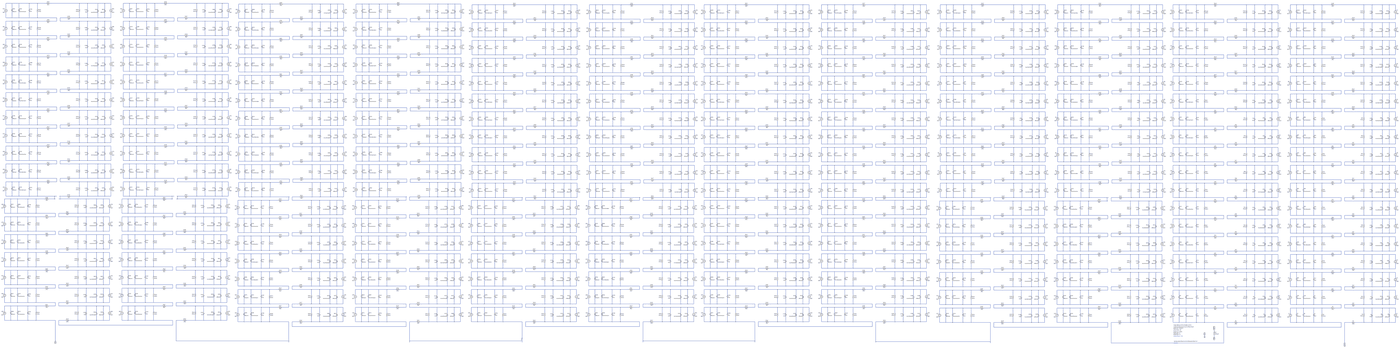
[diagram p0: schematic jac--m5sf-2--array.asc, whole sheet]
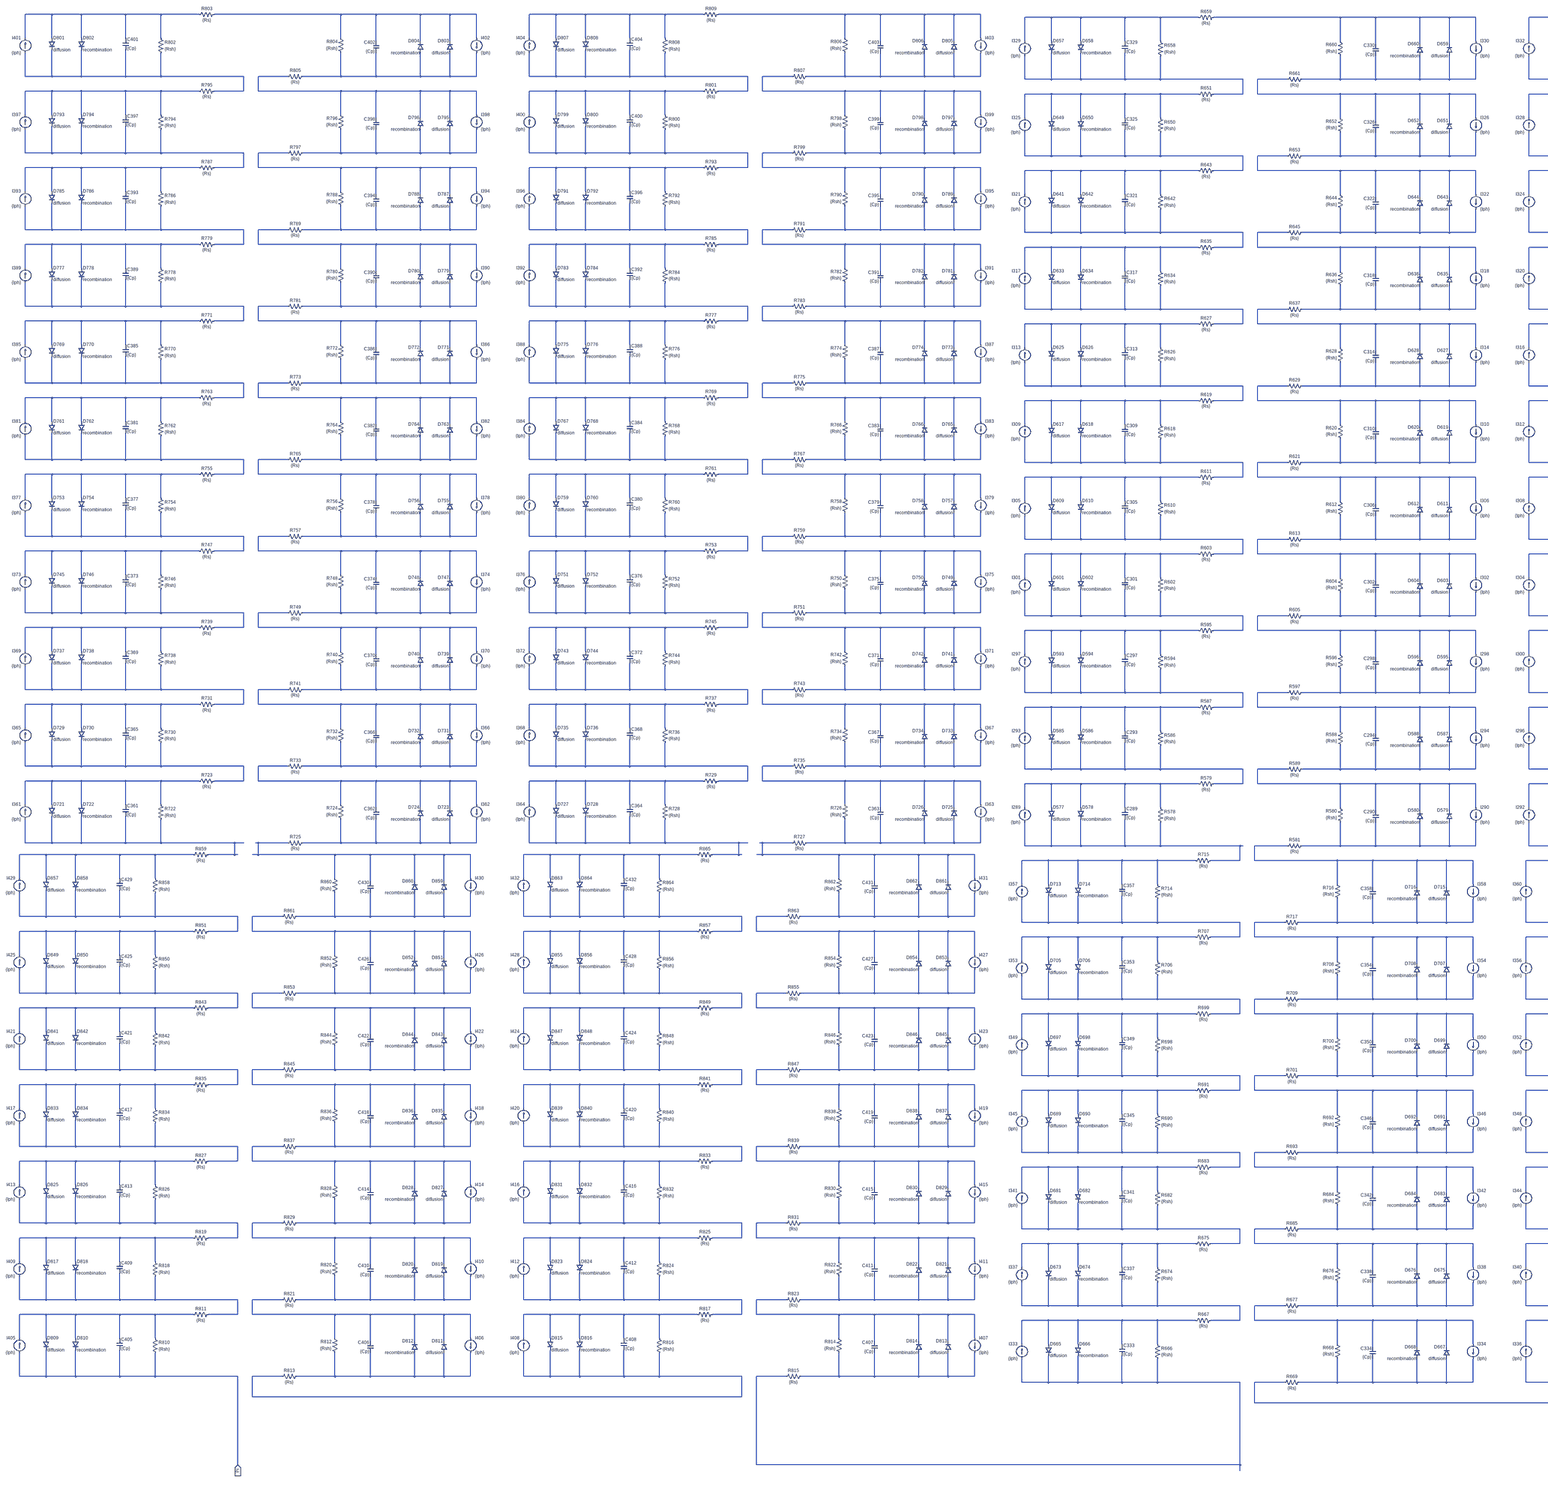
[diagram p1: schematic jac--m5sf-2--array.asc, part, row 1 of 1, column 1 of 4]
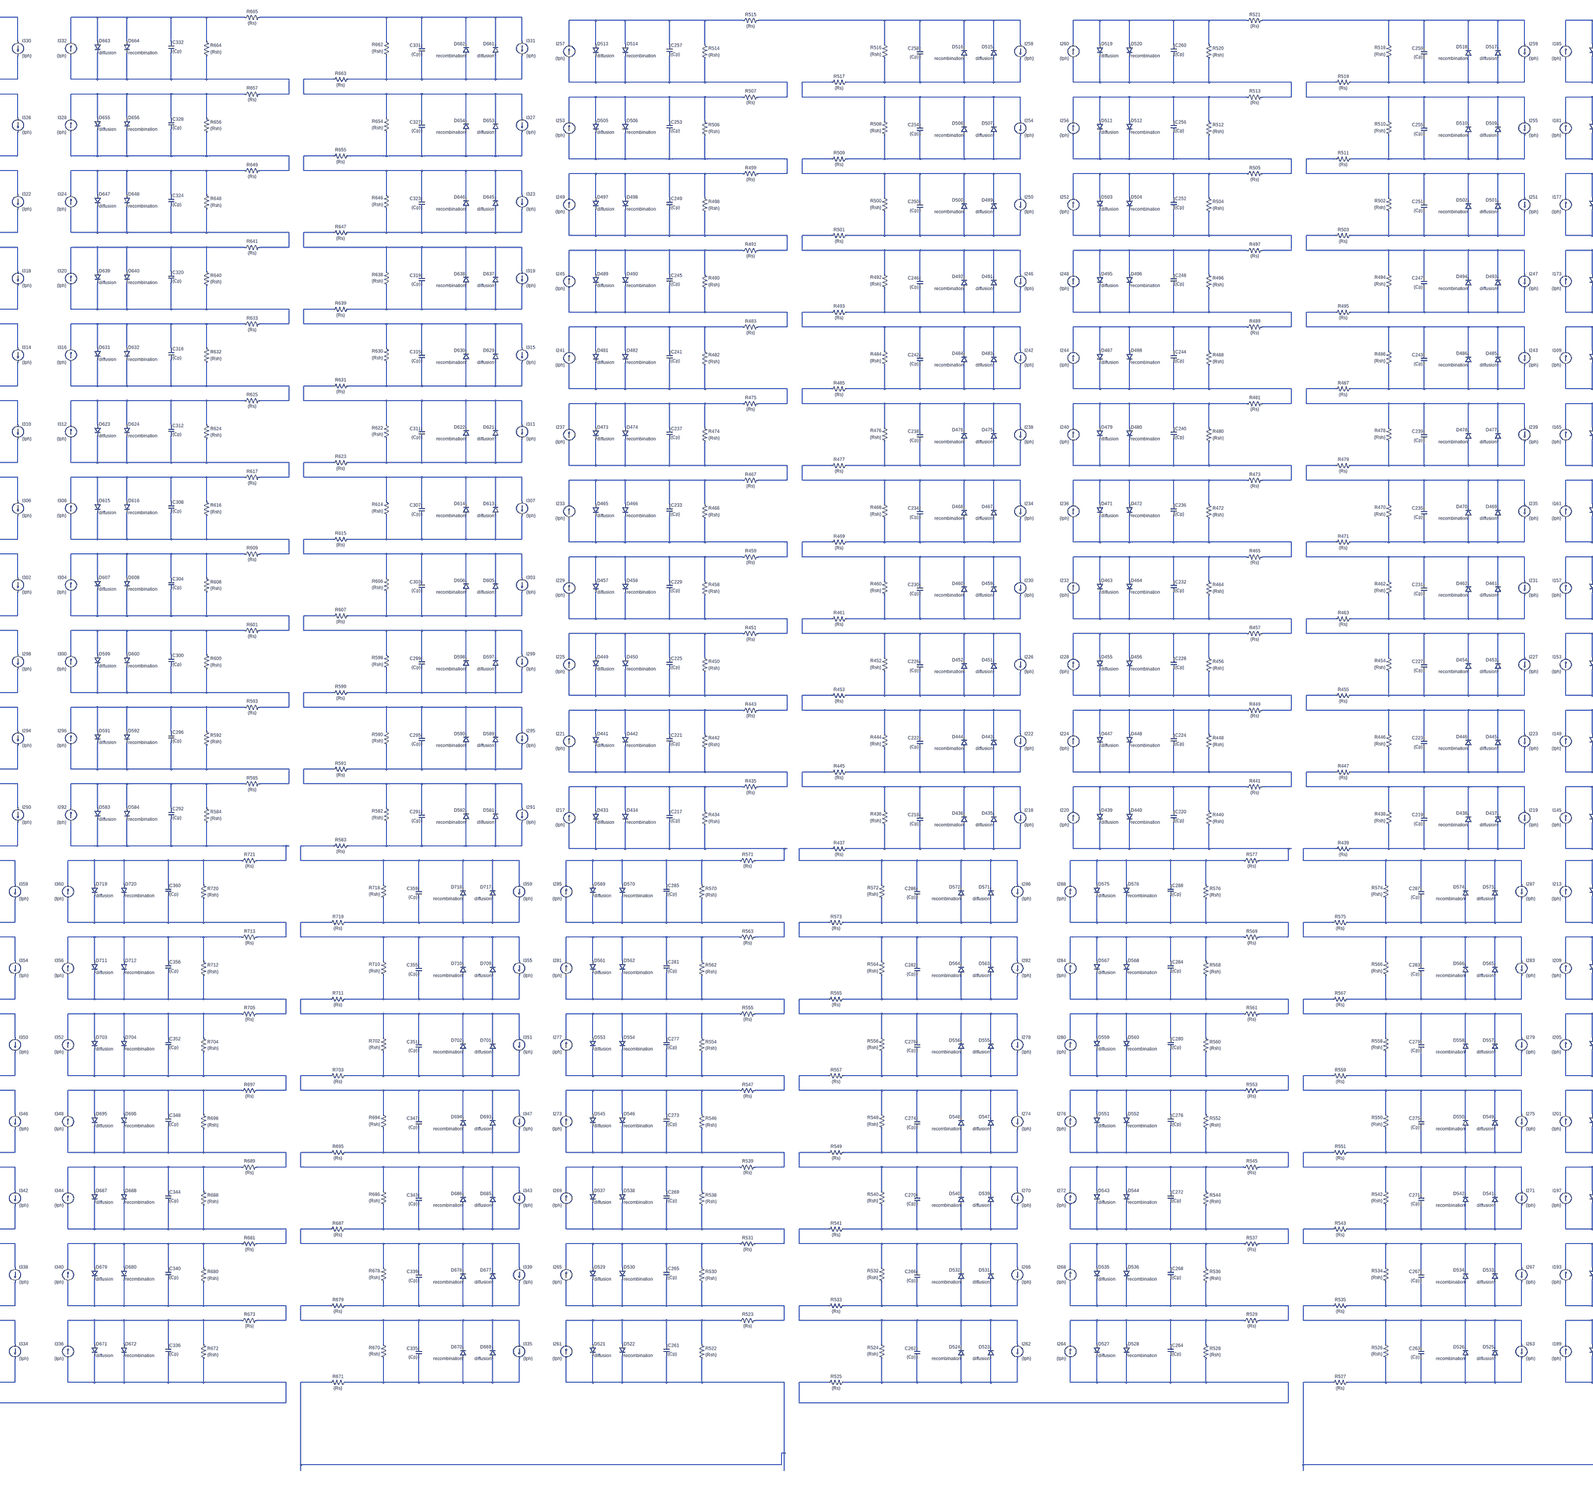
[diagram p2: schematic jac--m5sf-2--array.asc, part, row 1 of 1, column 2 of 4]
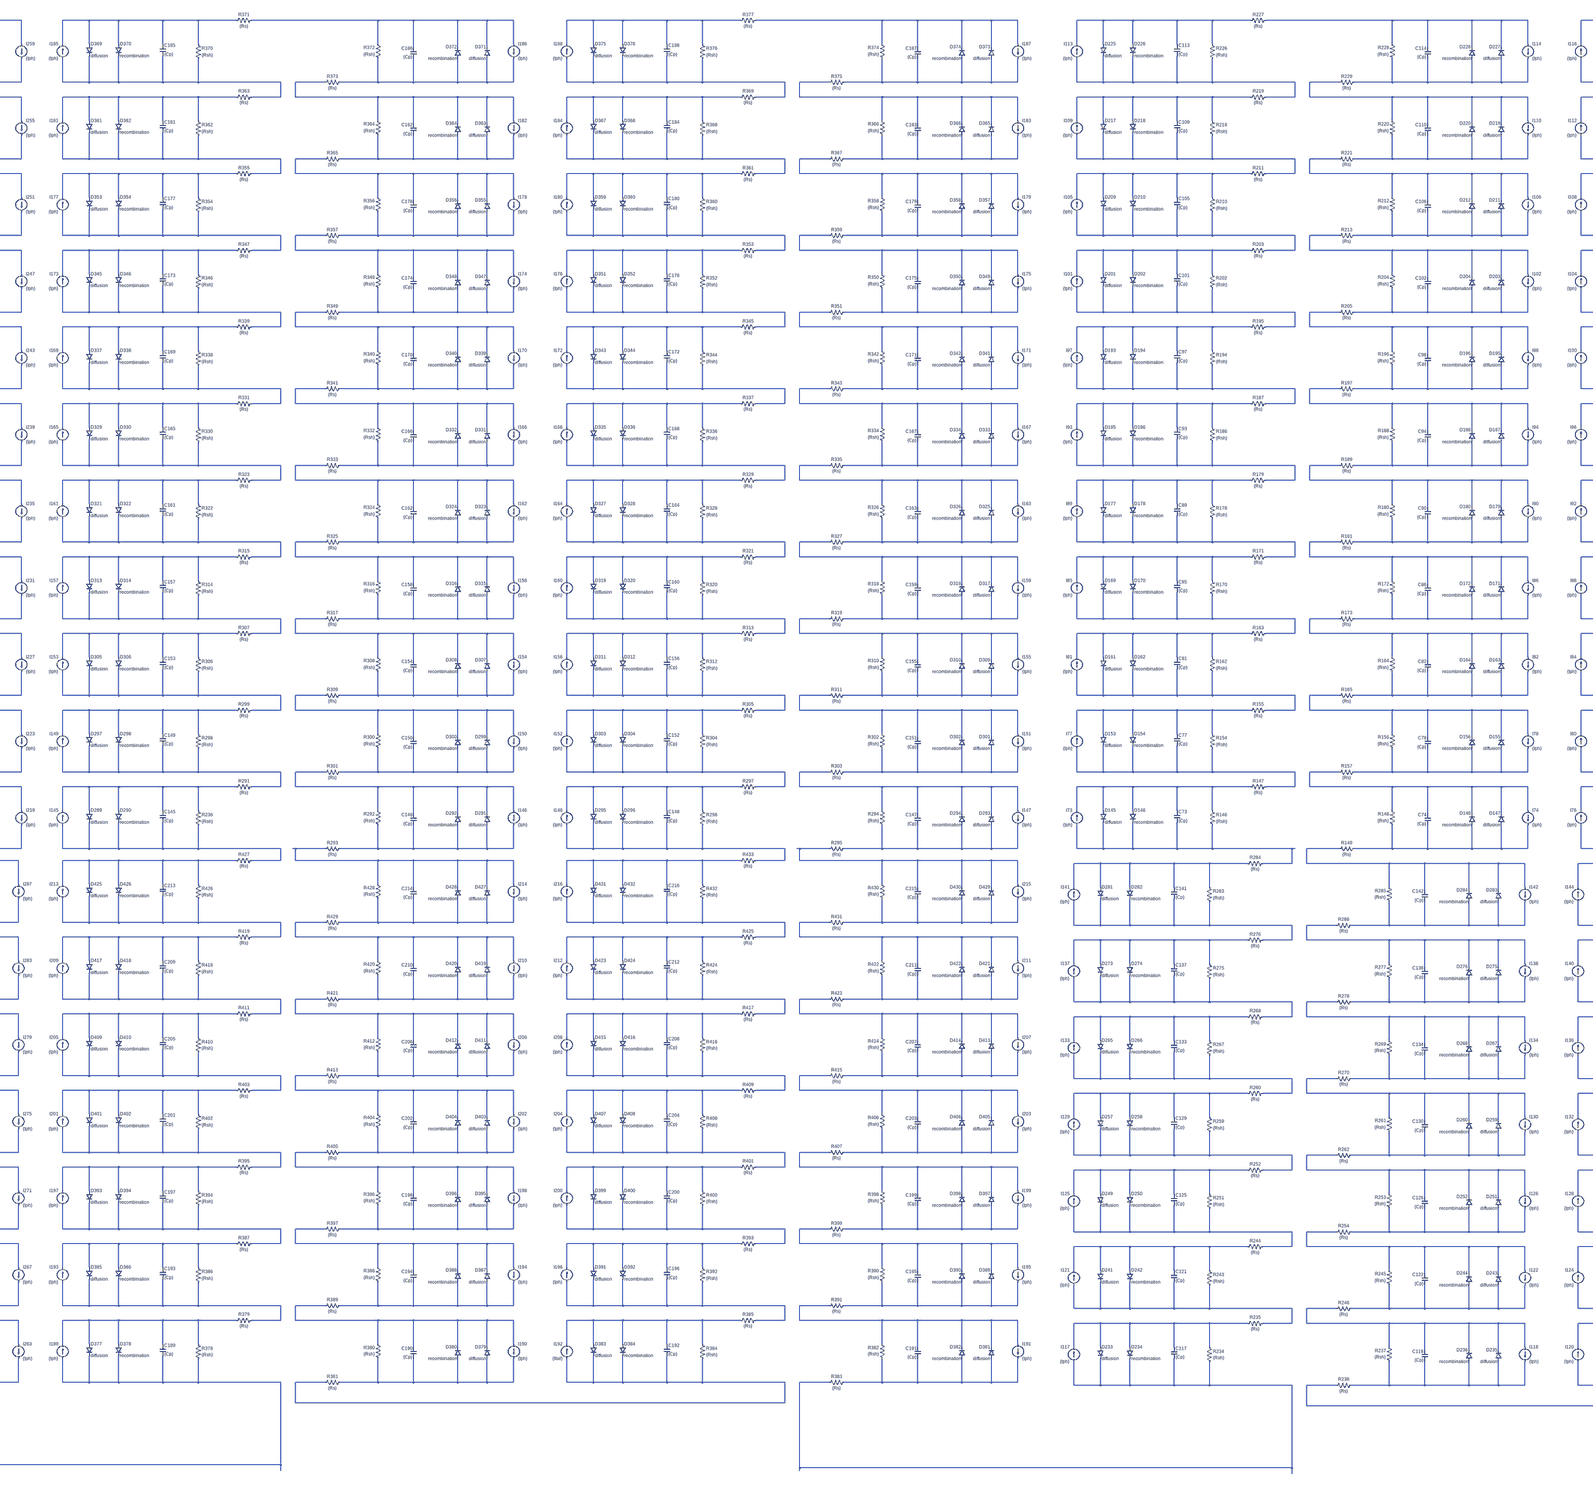
[diagram p3: schematic jac--m5sf-2--array.asc, part, row 1 of 1, column 3 of 4]
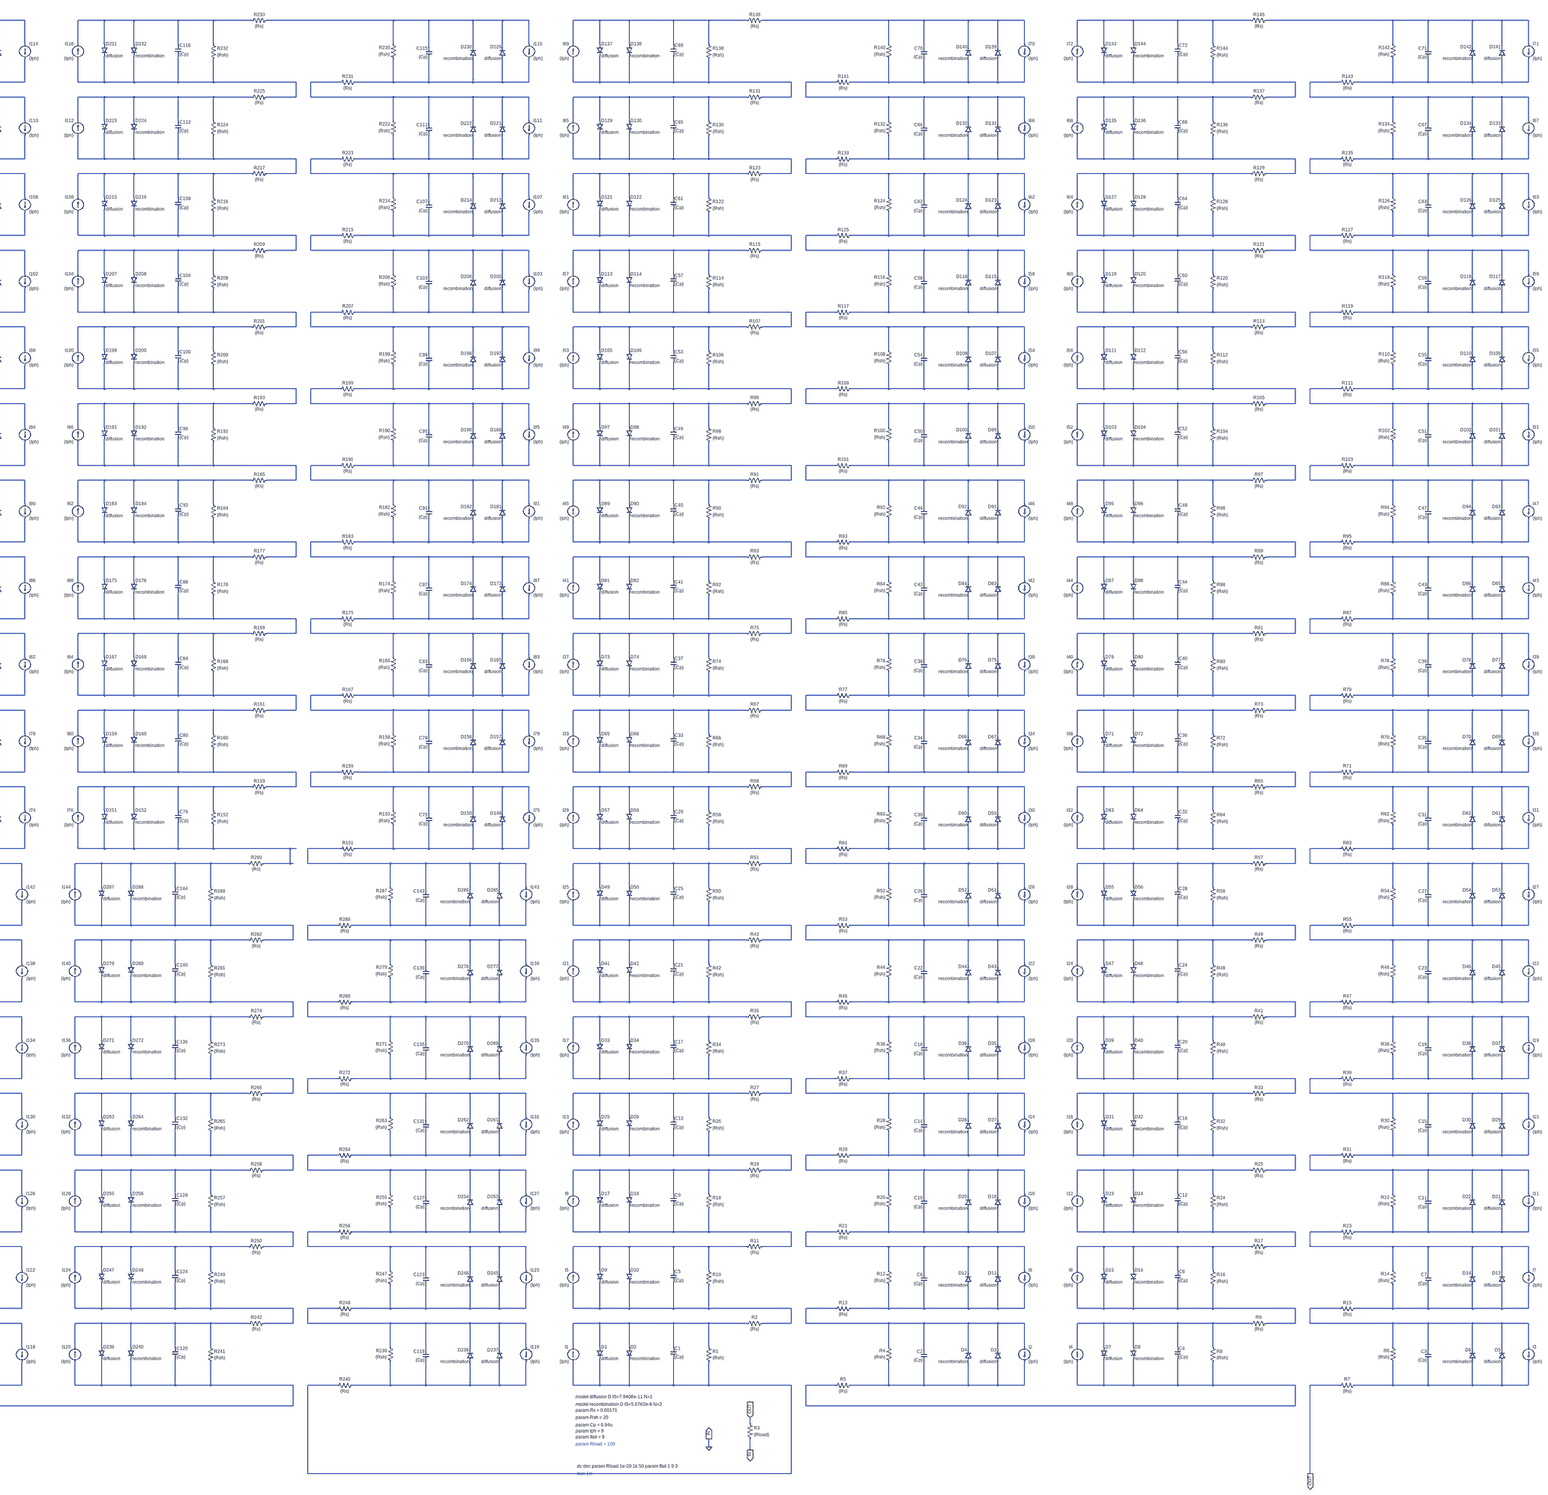
[diagram p4: schematic jac--m5sf-2--array.asc, part, row 1 of 1, column 4 of 4]
* jac--m5sf-2--array.asc
I1 N859 N839 {Iph}
D1 N839 N859 diffusion
D2 N839 N859 recombination
C1 N839 N859 {Cp}
R1 N839 N859 {Rsh}
R2 N839 N823 {Rs}
R3 OUT 0 {Rload}
I2 N824 N862 {Iph}
D3 N862 N824 diffusion
D4 N862 N824 recombination
C2 N862 N824 {Cp}
R4 N862 N824 {Rsh}
R5 N862 N861 {Rs}
I3 N827 N863 {Iph}
D5 N863 N827 diffusion
D6 N863 N827 recombination
C3 N863 N827 {Cp}
R6 N863 N827 {Rsh}
R7 N863 OUT {Rs}
I4 N861 N840 {Iph}
D7 N840 N861 diffusion
D8 N840 N861 recombination
C4 N840 N861 {Cp}
R8 N840 N861 {Rsh}
R9 N840 N826 {Rs}
I5 N823 N791 {Iph}
D9 N791 N823 diffusion
D10 N791 N823 recombination
C5 N791 N823 {Cp}
R10 N791 N823 {Rsh}
R11 N791 N775 {Rs}
I6 N776 N825 {Iph}
D11 N825 N776 diffusion
D12 N825 N776 recombination
C6 N825 N776 {Cp}
R12 N825 N776 {Rsh}
R13 N825 N824 {Rs}
I7 N779 N828 {Iph}
D13 N828 N779 diffusion
D14 N828 N779 recombination
C7 N828 N779 {Cp}
R14 N828 N779 {Rsh}
R15 N828 N827 {Rs}
I8 N826 N792 {Iph}
D15 N792 N826 diffusion
D16 N792 N826 recombination
C8 N792 N826 {Cp}
R16 N792 N826 {Rsh}
R17 N792 N778 {Rs}
I9 N775 N743 {Iph}
D17 N743 N775 diffusion
D18 N743 N775 recombination
C9 N743 N775 {Cp}
R18 N743 N775 {Rsh}
R19 N743 N727 {Rs}
I10 N728 N777 {Iph}
D19 N777 N728 diffusion
D20 N777 N728 recombination
C10 N777 N728 {Cp}
R20 N777 N728 {Rsh}
R21 N777 N776 {Rs}
I11 N731 N780 {Iph}
D21 N780 N731 diffusion
D22 N780 N731 recombination
C11 N780 N731 {Cp}
R22 N780 N731 {Rsh}
R23 N780 N779 {Rs}
I12 N778 N744 {Iph}
D23 N744 N778 diffusion
D24 N744 N778 recombination
C12 N744 N778 {Cp}
R24 N744 N778 {Rsh}
R25 N744 N730 {Rs}
I13 N727 N695 {Iph}
D25 N695 N727 diffusion
D26 N695 N727 recombination
C13 N695 N727 {Cp}
R26 N695 N727 {Rsh}
R27 N695 N679 {Rs}
I14 N680 N729 {Iph}
D27 N729 N680 diffusion
D28 N729 N680 recombination
C14 N729 N680 {Cp}
R28 N729 N680 {Rsh}
R29 N729 N728 {Rs}
I15 N683 N732 {Iph}
D29 N732 N683 diffusion
D30 N732 N683 recombination
C15 N732 N683 {Cp}
R30 N732 N683 {Rsh}
R31 N732 N731 {Rs}
I16 N730 N696 {Iph}
D31 N696 N730 diffusion
D32 N696 N730 recombination
C16 N696 N730 {Cp}
R32 N696 N730 {Rsh}
R33 N696 N682 {Rs}
I17 N679 N647 {Iph}
D33 N647 N679 diffusion
D34 N647 N679 recombination
C17 N647 N679 {Cp}
R34 N647 N679 {Rsh}
R35 N647 N631 {Rs}
I18 N632 N681 {Iph}
D35 N681 N632 diffusion
D36 N681 N632 recombination
C18 N681 N632 {Cp}
R36 N681 N632 {Rsh}
R37 N681 N680 {Rs}
I19 N635 N684 {Iph}
D37 N684 N635 diffusion
D38 N684 N635 recombination
C19 N684 N635 {Cp}
R38 N684 N635 {Rsh}
R39 N684 N683 {Rs}
I20 N682 N648 {Iph}
D39 N648 N682 diffusion
D40 N648 N682 recombination
C20 N648 N682 {Cp}
R40 N648 N682 {Rsh}
R41 N648 N634 {Rs}
I21 N631 N599 {Iph}
D41 N599 N631 diffusion
D42 N599 N631 recombination
C21 N599 N631 {Cp}
R42 N599 N631 {Rsh}
R43 N599 N583 {Rs}
I22 N584 N633 {Iph}
D43 N633 N584 diffusion
D44 N633 N584 recombination
C22 N633 N584 {Cp}
R44 N633 N584 {Rsh}
R45 N633 N632 {Rs}
I23 N587 N636 {Iph}
D45 N636 N587 diffusion
D46 N636 N587 recombination
C23 N636 N587 {Cp}
R46 N636 N587 {Rsh}
R47 N636 N635 {Rs}
I24 N634 N600 {Iph}
D47 N600 N634 diffusion
D48 N600 N634 recombination
C24 N600 N634 {Cp}
R48 N600 N634 {Rsh}
R49 N600 N586 {Rs}
I25 N583 N551 {Iph}
D49 N551 N583 diffusion
D50 N551 N583 recombination
C25 N551 N583 {Cp}
R50 N551 N583 {Rsh}
R51 N551 N535 {Rs}
I26 N536 N585 {Iph}
D51 N585 N536 diffusion
D52 N585 N536 recombination
C26 N585 N536 {Cp}
R52 N585 N536 {Rsh}
R53 N585 N584 {Rs}
I27 N539 N588 {Iph}
D53 N588 N539 diffusion
D54 N588 N539 recombination
C27 N588 N539 {Cp}
R54 N588 N539 {Rsh}
R55 N588 N587 {Rs}
I28 N586 N552 {Iph}
D55 N552 N586 diffusion
D56 N552 N586 recombination
C28 N552 N586 {Cp}
R56 N552 N586 {Rsh}
R57 N552 N538 {Rs}
I29 N535 N503 {Iph}
D57 N503 N535 diffusion
D58 N503 N535 recombination
C29 N503 N535 {Cp}
R58 N503 N535 {Rsh}
R59 N503 N487 {Rs}
I30 N488 N537 {Iph}
D59 N537 N488 diffusion
D60 N537 N488 recombination
C30 N537 N488 {Cp}
R60 N537 N488 {Rsh}
R61 N537 N536 {Rs}
I31 N491 N540 {Iph}
D61 N540 N491 diffusion
D62 N540 N491 recombination
C31 N540 N491 {Cp}
R62 N540 N491 {Rsh}
R63 N540 N539 {Rs}
I32 N538 N504 {Iph}
D63 N504 N538 diffusion
D64 N504 N538 recombination
C32 N504 N538 {Cp}
R64 N504 N538 {Rsh}
R65 N504 N490 {Rs}
I33 N487 N455 {Iph}
D65 N455 N487 diffusion
D66 N455 N487 recombination
C33 N455 N487 {Cp}
R66 N455 N487 {Rsh}
R67 N455 N439 {Rs}
I34 N440 N489 {Iph}
D67 N489 N440 diffusion
D68 N489 N440 recombination
C34 N489 N440 {Cp}
R68 N489 N440 {Rsh}
R69 N489 N488 {Rs}
I35 N443 N492 {Iph}
D69 N492 N443 diffusion
D70 N492 N443 recombination
C35 N492 N443 {Cp}
R70 N492 N443 {Rsh}
R71 N492 N491 {Rs}
I36 N490 N456 {Iph}
D71 N456 N490 diffusion
D72 N456 N490 recombination
C36 N456 N490 {Cp}
R72 N456 N490 {Rsh}
R73 N456 N442 {Rs}
I37 N439 N407 {Iph}
D73 N407 N439 diffusion
D74 N407 N439 recombination
C37 N407 N439 {Cp}
R74 N407 N439 {Rsh}
R75 N407 N391 {Rs}
I38 N392 N441 {Iph}
D75 N441 N392 diffusion
D76 N441 N392 recombination
C38 N441 N392 {Cp}
R76 N441 N392 {Rsh}
R77 N441 N440 {Rs}
I39 N395 N444 {Iph}
D77 N444 N395 diffusion
D78 N444 N395 recombination
C39 N444 N395 {Cp}
R78 N444 N395 {Rsh}
R79 N444 N443 {Rs}
I40 N442 N408 {Iph}
D79 N408 N442 diffusion
D80 N408 N442 recombination
C40 N408 N442 {Cp}
R80 N408 N442 {Rsh}
R81 N408 N394 {Rs}
I41 N391 N359 {Iph}
D81 N359 N391 diffusion
D82 N359 N391 recombination
C41 N359 N391 {Cp}
R82 N359 N391 {Rsh}
R83 N359 N343 {Rs}
I42 N344 N393 {Iph}
D83 N393 N344 diffusion
D84 N393 N344 recombination
C42 N393 N344 {Cp}
R84 N393 N344 {Rsh}
R85 N393 N392 {Rs}
I43 N347 N396 {Iph}
D85 N396 N347 diffusion
D86 N396 N347 recombination
C43 N396 N347 {Cp}
R86 N396 N347 {Rsh}
R87 N396 N395 {Rs}
I44 N394 N360 {Iph}
D87 N360 N394 diffusion
D88 N360 N394 recombination
C44 N360 N394 {Cp}
R88 N360 N394 {Rsh}
R89 N360 N346 {Rs}
I45 N343 N311 {Iph}
D89 N311 N343 diffusion
D90 N311 N343 recombination
C45 N311 N343 {Cp}
R90 N311 N343 {Rsh}
R91 N311 N295 {Rs}
I46 N296 N345 {Iph}
D91 N345 N296 diffusion
D92 N345 N296 recombination
C46 N345 N296 {Cp}
R92 N345 N296 {Rsh}
R93 N345 N344 {Rs}
I47 N299 N348 {Iph}
D93 N348 N299 diffusion
D94 N348 N299 recombination
C47 N348 N299 {Cp}
R94 N348 N299 {Rsh}
R95 N348 N347 {Rs}
I48 N346 N312 {Iph}
D95 N312 N346 diffusion
D96 N312 N346 recombination
C48 N312 N346 {Cp}
R96 N312 N346 {Rsh}
R97 N312 N298 {Rs}
I49 N295 N263 {Iph}
D97 N263 N295 diffusion
D98 N263 N295 recombination
C49 N263 N295 {Cp}
R98 N263 N295 {Rsh}
R99 N263 N247 {Rs}
I50 N248 N297 {Iph}
D99 N297 N248 diffusion
D100 N297 N248 recombination
C50 N297 N248 {Cp}
R100 N297 N248 {Rsh}
R101 N297 N296 {Rs}
I51 N251 N300 {Iph}
D101 N300 N251 diffusion
D102 N300 N251 recombination
C51 N300 N251 {Cp}
R102 N300 N251 {Rsh}
R103 N300 N299 {Rs}
I52 N298 N264 {Iph}
D103 N264 N298 diffusion
D104 N264 N298 recombination
C52 N264 N298 {Cp}
R104 N264 N298 {Rsh}
R105 N264 N250 {Rs}
I53 N247 N215 {Iph}
D105 N215 N247 diffusion
D106 N215 N247 recombination
C53 N215 N247 {Cp}
R106 N215 N247 {Rsh}
R107 N215 N199 {Rs}
I54 N200 N249 {Iph}
D107 N249 N200 diffusion
D108 N249 N200 recombination
C54 N249 N200 {Cp}
R108 N249 N200 {Rsh}
R109 N249 N248 {Rs}
I55 N203 N252 {Iph}
D109 N252 N203 diffusion
D110 N252 N203 recombination
C55 N252 N203 {Cp}
R110 N252 N203 {Rsh}
R111 N252 N251 {Rs}
I56 N250 N216 {Iph}
D111 N216 N250 diffusion
D112 N216 N250 recombination
C56 N216 N250 {Cp}
R112 N216 N250 {Rsh}
R113 N216 N202 {Rs}
I57 N199 N167 {Iph}
D113 N167 N199 diffusion
D114 N167 N199 recombination
C57 N167 N199 {Cp}
R114 N167 N199 {Rsh}
R115 N167 N151 {Rs}
I58 N152 N201 {Iph}
D115 N201 N152 diffusion
D116 N201 N152 recombination
C58 N201 N152 {Cp}
R116 N201 N152 {Rsh}
R117 N201 N200 {Rs}
I59 N155 N204 {Iph}
D117 N204 N155 diffusion
D118 N204 N155 recombination
C59 N204 N155 {Cp}
R118 N204 N155 {Rsh}
R119 N204 N203 {Rs}
I60 N202 N168 {Iph}
D119 N168 N202 diffusion
D120 N168 N202 recombination
C60 N168 N202 {Cp}
R120 N168 N202 {Rsh}
R121 N168 N154 {Rs}
I61 N151 N119 {Iph}
D121 N119 N151 diffusion
D122 N119 N151 recombination
C61 N119 N151 {Cp}
R122 N119 N151 {Rsh}
R123 N119 N103 {Rs}
I62 N104 N153 {Iph}
D123 N153 N104 diffusion
D124 N153 N104 recombination
C62 N153 N104 {Cp}
R124 N153 N104 {Rsh}
R125 N153 N152 {Rs}
I63 N107 N156 {Iph}
D125 N156 N107 diffusion
D126 N156 N107 recombination
C63 N156 N107 {Cp}
R126 N156 N107 {Rsh}
R127 N156 N155 {Rs}
I64 N154 N120 {Iph}
D127 N120 N154 diffusion
D128 N120 N154 recombination
C64 N120 N154 {Cp}
R128 N120 N154 {Rsh}
R129 N120 N106 {Rs}
I65 N103 N071 {Iph}
D129 N071 N103 diffusion
D130 N071 N103 recombination
C65 N071 N103 {Cp}
R130 N071 N103 {Rsh}
R131 N071 N055 {Rs}
I66 N056 N105 {Iph}
D131 N105 N056 diffusion
D132 N105 N056 recombination
C66 N105 N056 {Cp}
R132 N105 N056 {Rsh}
R133 N105 N104 {Rs}
I67 N059 N108 {Iph}
D133 N108 N059 diffusion
D134 N108 N059 recombination
C67 N108 N059 {Cp}
R134 N108 N059 {Rsh}
R135 N108 N107 {Rs}
I68 N106 N072 {Iph}
D135 N072 N106 diffusion
D136 N072 N106 recombination
C68 N072 N106 {Cp}
R136 N072 N106 {Rsh}
R137 N072 N058 {Rs}
I69 N055 N021 {Iph}
D137 N021 N055 diffusion
D138 N021 N055 recombination
C69 N021 N055 {Cp}
R138 N021 N055 {Rsh}
R139 N021 N022 {Rs}
I70 N022 N057 {Iph}
D139 N057 N022 diffusion
D140 N057 N022 recombination
C70 N057 N022 {Cp}
R140 N057 N022 {Rsh}
R141 N057 N056 {Rs}
I71 N024 N060 {Iph}
D141 N060 N024 diffusion
D142 N060 N024 recombination
C71 N060 N024 {Cp}
R142 N060 N024 {Rsh}
R143 N060 N059 {Rs}
I72 N058 N023 {Iph}
D143 N023 N058 diffusion
D144 N023 N058 recombination
C72 N023 N058 {Cp}
R144 N023 N058 {Rsh}
R145 N023 N024 {Rs}
I73 N529 N501 {Iph}
D145 N501 N529 diffusion
D146 N501 N529 recombination
C73 N501 N529 {Cp}
R146 N501 N529 {Rsh}
R147 N501 N481 {Rs}
I74 N482 N531 {Iph}
D147 N531 N482 diffusion
D148 N531 N482 recombination
C74 N531 N482 {Cp}
R148 N531 N482 {Rsh}
R149 N531 N530 {Rs}
I75 N485 N534 {Iph}
D149 N534 N485 diffusion
D150 N534 N485 recombination
C75 N534 N485 {Cp}
R150 N534 N485 {Rsh}
R151 N534 N533 {Rs}
I76 N532 N502 {Iph}
D151 N502 N532 diffusion
D152 N502 N532 recombination
C76 N502 N532 {Cp}
R152 N502 N532 {Rsh}
R153 N502 N484 {Rs}
I77 N481 N453 {Iph}
D153 N453 N481 diffusion
D154 N453 N481 recombination
C77 N453 N481 {Cp}
R154 N453 N481 {Rsh}
R155 N453 N433 {Rs}
I78 N434 N483 {Iph}
D155 N483 N434 diffusion
D156 N483 N434 recombination
C78 N483 N434 {Cp}
R156 N483 N434 {Rsh}
R157 N483 N482 {Rs}
I79 N437 N486 {Iph}
D157 N486 N437 diffusion
D158 N486 N437 recombination
C79 N486 N437 {Cp}
R158 N486 N437 {Rsh}
R159 N486 N485 {Rs}
I80 N484 N454 {Iph}
D159 N454 N484 diffusion
D160 N454 N484 recombination
C80 N454 N484 {Cp}
R160 N454 N484 {Rsh}
R161 N454 N436 {Rs}
I81 N433 N405 {Iph}
D161 N405 N433 diffusion
D162 N405 N433 recombination
C81 N405 N433 {Cp}
R162 N405 N433 {Rsh}
R163 N405 N385 {Rs}
I82 N386 N435 {Iph}
D163 N435 N386 diffusion
D164 N435 N386 recombination
C82 N435 N386 {Cp}
R164 N435 N386 {Rsh}
R165 N435 N434 {Rs}
I83 N389 N438 {Iph}
D165 N438 N389 diffusion
D166 N438 N389 recombination
C83 N438 N389 {Cp}
R166 N438 N389 {Rsh}
R167 N438 N437 {Rs}
I84 N436 N406 {Iph}
D167 N406 N436 diffusion
D168 N406 N436 recombination
C84 N406 N436 {Cp}
R168 N406 N436 {Rsh}
R169 N406 N388 {Rs}
I85 N385 N357 {Iph}
D169 N357 N385 diffusion
D170 N357 N385 recombination
C85 N357 N385 {Cp}
R170 N357 N385 {Rsh}
R171 N357 N337 {Rs}
I86 N338 N387 {Iph}
D171 N387 N338 diffusion
D172 N387 N338 recombination
C86 N387 N338 {Cp}
R172 N387 N338 {Rsh}
R173 N387 N386 {Rs}
I87 N341 N390 {Iph}
D173 N390 N341 diffusion
D174 N390 N341 recombination
C87 N390 N341 {Cp}
R174 N390 N341 {Rsh}
R175 N390 N389 {Rs}
I88 N388 N358 {Iph}
D175 N358 N388 diffusion
D176 N358 N388 recombination
C88 N358 N388 {Cp}
R176 N358 N388 {Rsh}
R177 N358 N340 {Rs}
I89 N337 N309 {Iph}
D177 N309 N337 diffusion
D178 N309 N337 recombination
C89 N309 N337 {Cp}
R178 N309 N337 {Rsh}
R179 N309 N289 {Rs}
I90 N290 N339 {Iph}
D179 N339 N290 diffusion
D180 N339 N290 recombination
C90 N339 N290 {Cp}
R180 N339 N290 {Rsh}
R181 N339 N338 {Rs}
I91 N293 N342 {Iph}
D181 N342 N293 diffusion
D182 N342 N293 recombination
C91 N342 N293 {Cp}
R182 N342 N293 {Rsh}
R183 N342 N341 {Rs}
I92 N340 N310 {Iph}
D183 N310 N340 diffusion
D184 N310 N340 recombination
C92 N310 N340 {Cp}
R184 N310 N340 {Rsh}
R185 N310 N292 {Rs}
I93 N289 N261 {Iph}
D185 N261 N289 diffusion
D186 N261 N289 recombination
C93 N261 N289 {Cp}
R186 N261 N289 {Rsh}
R187 N261 N241 {Rs}
I94 N242 N291 {Iph}
D187 N291 N242 diffusion
D188 N291 N242 recombination
C94 N291 N242 {Cp}
R188 N291 N242 {Rsh}
R189 N291 N290 {Rs}
I95 N245 N294 {Iph}
D189 N294 N245 diffusion
D190 N294 N245 recombination
C95 N294 N245 {Cp}
R190 N294 N245 {Rsh}
R191 N294 N293 {Rs}
I96 N292 N262 {Iph}
D191 N262 N292 diffusion
D192 N262 N292 recombination
C96 N262 N292 {Cp}
R192 N262 N292 {Rsh}
R193 N262 N244 {Rs}
I97 N241 N213 {Iph}
D193 N213 N241 diffusion
D194 N213 N241 recombination
C97 N213 N241 {Cp}
R194 N213 N241 {Rsh}
R195 N213 N193 {Rs}
I98 N194 N243 {Iph}
D195 N243 N194 diffusion
D196 N243 N194 recombination
C98 N243 N194 {Cp}
R196 N243 N194 {Rsh}
R197 N243 N242 {Rs}
I99 N197 N246 {Iph}
D197 N246 N197 diffusion
D198 N246 N197 recombination
C99 N246 N197 {Cp}
R198 N246 N197 {Rsh}
R199 N246 N245 {Rs}
I100 N244 N214 {Iph}
D199 N214 N244 diffusion
D200 N214 N244 recombination
C100 N214 N244 {Cp}
R200 N214 N244 {Rsh}
R201 N214 N196 {Rs}
I101 N193 N165 {Iph}
D201 N165 N193 diffusion
D202 N165 N193 recombination
C101 N165 N193 {Cp}
R202 N165 N193 {Rsh}
R203 N165 N145 {Rs}
I102 N146 N195 {Iph}
D203 N195 N146 diffusion
D204 N195 N146 recombination
C102 N195 N146 {Cp}
R204 N195 N146 {Rsh}
R205 N195 N194 {Rs}
I103 N149 N198 {Iph}
D205 N198 N149 diffusion
D206 N198 N149 recombination
C103 N198 N149 {Cp}
R206 N198 N149 {Rsh}
R207 N198 N197 {Rs}
I104 N196 N166 {Iph}
D207 N166 N196 diffusion
D208 N166 N196 recombination
C104 N166 N196 {Cp}
R208 N166 N196 {Rsh}
R209 N166 N148 {Rs}
I105 N145 N117 {Iph}
D209 N117 N145 diffusion
D210 N117 N145 recombination
C105 N117 N145 {Cp}
R210 N117 N145 {Rsh}
R211 N117 N097 {Rs}
I106 N098 N147 {Iph}
D211 N147 N098 diffusion
D212 N147 N098 recombination
C106 N147 N098 {Cp}
R212 N147 N098 {Rsh}
R213 N147 N146 {Rs}
I107 N101 N150 {Iph}
D213 N150 N101 diffusion
D214 N150 N101 recombination
C107 N150 N101 {Cp}
R214 N150 N101 {Rsh}
R215 N150 N149 {Rs}
I108 N148 N118 {Iph}
D215 N118 N148 diffusion
D216 N118 N148 recombination
C108 N118 N148 {Cp}
R216 N118 N148 {Rsh}
R217 N118 N100 {Rs}
I109 N097 N069 {Iph}
D217 N069 N097 diffusion
D218 N069 N097 recombination
C109 N069 N097 {Cp}
R218 N069 N097 {Rsh}
R219 N069 N049 {Rs}
I110 N050 N099 {Iph}
D219 N099 N050 diffusion
D220 N099 N050 recombination
C110 N099 N050 {Cp}
R220 N099 N050 {Rsh}
R221 N099 N098 {Rs}
I111 N053 N102 {Iph}
D221 N102 N053 diffusion
D222 N102 N053 recombination
C111 N102 N053 {Cp}
R222 N102 N053 {Rsh}
R223 N102 N101 {Rs}
I112 N100 N070 {Iph}
D223 N070 N100 diffusion
D224 N070 N100 recombination
C112 N070 N100 {Cp}
R224 N070 N100 {Rsh}
R225 N070 N052 {Rs}
I113 N049 N017 {Iph}
D225 N017 N049 diffusion
D226 N017 N049 recombination
C113 N017 N049 {Cp}
R226 N017 N049 {Rsh}
R227 N017 N018 {Rs}
I114 N018 N051 {Iph}
D227 N051 N018 diffusion
D228 N051 N018 recombination
C114 N051 N018 {Cp}
R228 N051 N018 {Rsh}
R229 N051 N050 {Rs}
I115 N020 N054 {Iph}
D229 N054 N020 diffusion
D230 N054 N020 recombination
C115 N054 N020 {Cp}
R230 N054 N020 {Rsh}
R231 N054 N053 {Rs}
I116 N052 N019 {Iph}
D231 N019 N052 diffusion
D232 N019 N052 recombination
C116 N019 N052 {Cp}
R232 N019 N052 {Rsh}
R233 N019 N020 {Rs}
I117 N855 N837 {Iph}
D233 N837 N855 diffusion
D234 N837 N855 recombination
C117 N837 N855 {Cp}
R234 N837 N855 {Rsh}
R235 N837 N817 {Rs}
I118 N818 N858 {Iph}
D235 N858 N818 diffusion
D236 N858 N818 recombination
C118 N858 N818 {Cp}
R237 N858 N818 {Rsh}
R238 N858 N857 {Rs}
I119 N821 N860 {Iph}
D237 N860 N821 diffusion
D238 N860 N821 recombination
C119 N860 N821 {Cp}
R239 N860 N821 {Rsh}
R240 N860 N859 {Rs}
I120 N857 N838 {Iph}
D239 N838 N857 diffusion
D240 N838 N857 recombination
C120 N838 N857 {Cp}
R241 N838 N857 {Rsh}
R242 N838 N820 {Rs}
I121 N817 N789 {Iph}
D241 N789 N817 diffusion
D242 N789 N817 recombination
C121 N789 N817 {Cp}
R243 N789 N817 {Rsh}
R244 N789 N769 {Rs}
I122 N770 N819 {Iph}
D243 N819 N770 diffusion
D244 N819 N770 recombination
C122 N819 N770 {Cp}
R245 N819 N770 {Rsh}
R246 N819 N818 {Rs}
I123 N773 N822 {Iph}
D245 N822 N773 diffusion
D246 N822 N773 recombination
C123 N822 N773 {Cp}
R247 N822 N773 {Rsh}
R248 N822 N821 {Rs}
I124 N820 N790 {Iph}
D247 N790 N820 diffusion
D248 N790 N820 recombination
C124 N790 N820 {Cp}
R249 N790 N820 {Rsh}
R250 N790 N772 {Rs}
I125 N769 N741 {Iph}
D249 N741 N769 diffusion
D250 N741 N769 recombination
C125 N741 N769 {Cp}
R251 N741 N769 {Rsh}
R252 N741 N721 {Rs}
I126 N722 N771 {Iph}
D251 N771 N722 diffusion
D252 N771 N722 recombination
C126 N771 N722 {Cp}
R253 N771 N722 {Rsh}
R254 N771 N770 {Rs}
I127 N725 N774 {Iph}
D253 N774 N725 diffusion
D254 N774 N725 recombination
C127 N774 N725 {Cp}
R255 N774 N725 {Rsh}
R256 N774 N773 {Rs}
I128 N772 N742 {Iph}
D255 N742 N772 diffusion
D256 N742 N772 recombination
C128 N742 N772 {Cp}
R257 N742 N772 {Rsh}
R258 N742 N724 {Rs}
I129 N721 N693 {Iph}
D257 N693 N721 diffusion
D258 N693 N721 recombination
C129 N693 N721 {Cp}
R259 N693 N721 {Rsh}
R260 N693 N673 {Rs}
I130 N674 N723 {Iph}
D259 N723 N674 diffusion
D260 N723 N674 recombination
C130 N723 N674 {Cp}
R261 N723 N674 {Rsh}
R262 N723 N722 {Rs}
I131 N677 N726 {Iph}
D261 N726 N677 diffusion
D262 N726 N677 recombination
C131 N726 N677 {Cp}
R263 N726 N677 {Rsh}
R264 N726 N725 {Rs}
I132 N724 N694 {Iph}
D263 N694 N724 diffusion
D264 N694 N724 recombination
C132 N694 N724 {Cp}
R265 N694 N724 {Rsh}
R266 N694 N676 {Rs}
I133 N673 N645 {Iph}
D265 N645 N673 diffusion
D266 N645 N673 recombination
C133 N645 N673 {Cp}
R267 N645 N673 {Rsh}
R268 N645 N625 {Rs}
I134 N626 N675 {Iph}
D267 N675 N626 diffusion
D268 N675 N626 recombination
C134 N675 N626 {Cp}
R269 N675 N626 {Rsh}
R270 N675 N674 {Rs}
I135 N629 N678 {Iph}
D269 N678 N629 diffusion
D270 N678 N629 recombination
C135 N678 N629 {Cp}
R271 N678 N629 {Rsh}
R272 N678 N677 {Rs}
I136 N676 N646 {Iph}
D271 N646 N676 diffusion
D272 N646 N676 recombination
C136 N646 N676 {Cp}
R273 N646 N676 {Rsh}
R274 N646 N628 {Rs}
I137 N625 N597 {Iph}
D273 N597 N625 diffusion
D274 N597 N625 recombination
C137 N597 N625 {Cp}
R275 N597 N625 {Rsh}
R276 N597 N577 {Rs}
I138 N578 N627 {Iph}
D275 N627 N578 diffusion
D276 N627 N578 recombination
C138 N627 N578 {Cp}
R277 N627 N578 {Rsh}
R278 N627 N626 {Rs}
I139 N581 N630 {Iph}
D277 N630 N581 diffusion
D278 N630 N581 recombination
C139 N630 N581 {Cp}
R279 N630 N581 {Rsh}
R280 N630 N629 {Rs}
I140 N628 N598 {Iph}
D279 N598 N628 diffusion
D280 N598 N628 recombination
C140 N598 N628 {Cp}
R281 N598 N628 {Rsh}
R282 N598 N580 {Rs}
I141 N577 N549 {Iph}
D281 N549 N577 diffusion
D282 N549 N577 recombination
C141 N549 N577 {Cp}
R283 N549 N577 {Rsh}
R284 N549 N529 {Rs}
I142 N530 N579 {Iph}
D283 N579 N530 diffusion
D284 N579 N530 recombination
C142 N579 N530 {Cp}
R285 N579 N530 {Rsh}
R286 N579 N578 {Rs}
I143 N533 N582 {Iph}
D285 N582 N533 diffusion
D286 N582 N533 recombination
C143 N582 N533 {Cp}
R287 N582 N533 {Rsh}
R288 N582 N581 {Rs}
I144 N580 N550 {Iph}
D287 N550 N580 diffusion
D288 N550 N580 recombination
C144 N550 N580 {Cp}
R289 N550 N580 {Rsh}
R290 N550 N532 {Rs}
I145 N523 N499 {Iph}
D289 N499 N523 diffusion
D290 N499 N523 recombination
C145 N499 N523 {Cp}
R236 N499 N523 {Rsh}
R291 N499 N475 {Rs}
I146 N476 N525 {Iph}
D291 N525 N476 diffusion
D292 N525 N476 recombination
C146 N525 N476 {Cp}
R292 N525 N476 {Rsh}
R293 N525 N524 {Rs}
I147 N479 N528 {Iph}
D293 N528 N479 diffusion
D294 N528 N479 recombination
C147 N528 N479 {Cp}
R294 N528 N479 {Rsh}
R295 N528 N527 {Rs}
I148 N526 N500 {Iph}
D295 N500 N526 diffusion
D296 N500 N526 recombination
C148 N500 N526 {Cp}
R296 N500 N526 {Rsh}
R297 N500 N478 {Rs}
I149 N475 N451 {Iph}
D297 N451 N475 diffusion
D298 N451 N475 recombination
C149 N451 N475 {Cp}
R298 N451 N475 {Rsh}
R299 N451 N427 {Rs}
I150 N428 N477 {Iph}
D299 N477 N428 diffusion
D300 N477 N428 recombination
C150 N477 N428 {Cp}
R300 N477 N428 {Rsh}
R301 N477 N476 {Rs}
I151 N431 N480 {Iph}
D301 N480 N431 diffusion
D302 N480 N431 recombination
C151 N480 N431 {Cp}
R302 N480 N431 {Rsh}
R303 N480 N479 {Rs}
I152 N478 N452 {Iph}
D303 N452 N478 diffusion
D304 N452 N478 recombination
C152 N452 N478 {Cp}
R304 N452 N478 {Rsh}
R305 N452 N430 {Rs}
I153 N427 N403 {Iph}
D305 N403 N427 diffusion
D306 N403 N427 recombination
C153 N403 N427 {Cp}
R306 N403 N427 {Rsh}
R307 N403 N379 {Rs}
I154 N380 N429 {Iph}
D307 N429 N380 diffusion
D308 N429 N380 recombination
C154 N429 N380 {Cp}
R308 N429 N380 {Rsh}
R309 N429 N428 {Rs}
I155 N383 N432 {Iph}
D309 N432 N383 diffusion
D310 N432 N383 recombination
C155 N432 N383 {Cp}
R310 N432 N383 {Rsh}
R311 N432 N431 {Rs}
I156 N430 N404 {Iph}
D311 N404 N430 diffusion
D312 N404 N430 recombination
C156 N404 N430 {Cp}
R312 N404 N430 {Rsh}
R313 N404 N382 {Rs}
I157 N379 N355 {Iph}
D313 N355 N379 diffusion
D314 N355 N379 recombination
C157 N355 N379 {Cp}
R314 N355 N379 {Rsh}
R315 N355 N331 {Rs}
I158 N332 N381 {Iph}
D315 N381 N332 diffusion
D316 N381 N332 recombination
C158 N381 N332 {Cp}
R316 N381 N332 {Rsh}
R317 N381 N380 {Rs}
I159 N335 N384 {Iph}
D317 N384 N335 diffusion
D318 N384 N335 recombination
C159 N384 N335 {Cp}
R318 N384 N335 {Rsh}
R319 N384 N383 {Rs}
I160 N382 N356 {Iph}
D319 N356 N382 diffusion
D320 N356 N382 recombination
C160 N356 N382 {Cp}
R320 N356 N382 {Rsh}
R321 N356 N334 {Rs}
I161 N331 N307 {Iph}
D321 N307 N331 diffusion
D322 N307 N331 recombination
C161 N307 N331 {Cp}
R322 N307 N331 {Rsh}
R323 N307 N283 {Rs}
I162 N284 N333 {Iph}
D323 N333 N284 diffusion
D324 N333 N284 recombination
C162 N333 N284 {Cp}
R324 N333 N284 {Rsh}
R325 N333 N332 {Rs}
I163 N287 N336 {Iph}
D325 N336 N287 diffusion
D326 N336 N287 recombination
C163 N336 N287 {Cp}
R326 N336 N287 {Rsh}
R327 N336 N335 {Rs}
I164 N334 N308 {Iph}
D327 N308 N334 diffusion
D328 N308 N334 recombination
C164 N308 N334 {Cp}
R328 N308 N334 {Rsh}
R329 N308 N286 {Rs}
I165 N283 N259 {Iph}
D329 N259 N283 diffusion
D330 N259 N283 recombination
C165 N259 N283 {Cp}
R330 N259 N283 {Rsh}
R331 N259 N235 {Rs}
I166 N236 N285 {Iph}
D331 N285 N236 diffusion
D332 N285 N236 recombination
C166 N285 N236 {Cp}
R332 N285 N236 {Rsh}
R333 N285 N284 {Rs}
I167 N239 N288 {Iph}
D333 N288 N239 diffusion
D334 N288 N239 recombination
C167 N288 N239 {Cp}
R334 N288 N239 {Rsh}
R335 N288 N287 {Rs}
I168 N286 N260 {Iph}
D335 N260 N286 diffusion
D336 N260 N286 recombination
C168 N260 N286 {Cp}
R336 N260 N286 {Rsh}
R337 N260 N238 {Rs}
I169 N235 N211 {Iph}
D337 N211 N235 diffusion
D338 N211 N235 recombination
C169 N211 N235 {Cp}
R338 N211 N235 {Rsh}
R339 N211 N187 {Rs}
I170 N188 N237 {Iph}
D339 N237 N188 diffusion
D340 N237 N188 recombination
C170 N237 N188 {Cp}
R340 N237 N188 {Rsh}
R341 N237 N236 {Rs}
I171 N191 N240 {Iph}
D341 N240 N191 diffusion
D342 N240 N191 recombination
C171 N240 N191 {Cp}
R342 N240 N191 {Rsh}
R343 N240 N239 {Rs}
I172 N238 N212 {Iph}
D343 N212 N238 diffusion
D344 N212 N238 recombination
C172 N212 N238 {Cp}
R344 N212 N238 {Rsh}
R345 N212 N190 {Rs}
I173 N187 N163 {Iph}
D345 N163 N187 diffusion
D346 N163 N187 recombination
C173 N163 N187 {Cp}
R346 N163 N187 {Rsh}
R347 N163 N139 {Rs}
I174 N140 N189 {Iph}
D347 N189 N140 diffusion
D348 N189 N140 recombination
C174 N189 N140 {Cp}
R348 N189 N140 {Rsh}
R349 N189 N188 {Rs}
I175 N143 N192 {Iph}
D349 N192 N143 diffusion
D350 N192 N143 recombination
C175 N192 N143 {Cp}
R350 N192 N143 {Rsh}
R351 N192 N191 {Rs}
I176 N190 N164 {Iph}
D351 N164 N190 diffusion
D352 N164 N190 recombination
C176 N164 N190 {Cp}
R352 N164 N190 {Rsh}
R353 N164 N142 {Rs}
I177 N139 N115 {Iph}
D353 N115 N139 diffusion
D354 N115 N139 recombination
C177 N115 N139 {Cp}
R354 N115 N139 {Rsh}
R355 N115 N091 {Rs}
I178 N092 N141 {Iph}
D355 N141 N092 diffusion
D356 N141 N092 recombination
C178 N141 N092 {Cp}
R356 N141 N092 {Rsh}
R357 N141 N140 {Rs}
I179 N095 N144 {Iph}
D357 N144 N095 diffusion
D358 N144 N095 recombination
C179 N144 N095 {Cp}
R358 N144 N095 {Rsh}
R359 N144 N143 {Rs}
I180 N142 N116 {Iph}
D359 N116 N142 diffusion
D360 N116 N142 recombination
C180 N116 N142 {Cp}
R360 N116 N142 {Rsh}
R361 N116 N094 {Rs}
I181 N091 N067 {Iph}
D361 N067 N091 diffusion
D362 N067 N091 recombination
C181 N067 N091 {Cp}
R362 N067 N091 {Rsh}
R363 N067 N043 {Rs}
I182 N044 N093 {Iph}
D363 N093 N044 diffusion
D364 N093 N044 recombination
C182 N093 N044 {Cp}
R364 N093 N044 {Rsh}
R365 N093 N092 {Rs}
I183 N047 N096 {Iph}
D365 N096 N047 diffusion
D366 N096 N047 recombination
C183 N096 N047 {Cp}
R366 N096 N047 {Rsh}
R367 N096 N095 {Rs}
I184 N094 N068 {Iph}
D367 N068 N094 diffusion
D368 N068 N094 recombination
C184 N068 N094 {Cp}
R368 N068 N094 {Rsh}
R369 N068 N046 {Rs}
I185 N043 N013 {Iph}
D369 N013 N043 diffusion
D370 N013 N043 recombination
C185 N013 N043 {Cp}
R370 N013 N043 {Rsh}
R371 N013 N014 {Rs}
I186 N014 N045 {Iph}
D371 N045 N014 diffusion
D372 N045 N014 recombination
C186 N045 N014 {Cp}
R372 N045 N014 {Rsh}
R373 N045 N044 {Rs}
I187 N016 N048 {Iph}
D373 N048 N016 diffusion
D374 N048 N016 recombination
C187 N048 N016 {Cp}
R374 N048 N016 {Rsh}
R375 N048 N047 {Rs}
I188 N046 N015 {Iph}
D375 N015 N046 diffusion
D376 N015 N046 recombination
C188 N015 N046 {Cp}
R376 N015 N046 {Rsh}
R377 N015 N016 {Rs}
I189 N851 N835 {Iph}
D377 N835 N851 diffusion
D378 N835 N851 recombination
C189 N835 N851 {Cp}
R378 N835 N851 {Rsh}
R379 N835 N811 {Rs}
I190 N812 N854 {Iph}
D379 N854 N812 diffusion
D380 N854 N812 recombination
C190 N854 N812 {Cp}
R380 N854 N812 {Rsh}
R381 N854 N853 {Rs}
I191 N815 N856 {Iph}
D381 N856 N815 diffusion
D382 N856 N815 recombination
C191 N856 N815 {Cp}
R382 N856 N815 {Rsh}
R383 N856 N855 {Rs}
I192 N853 N836 {Ifail}
D383 N836 N853 diffusion
D384 N836 N853 recombination
C192 N836 N853 {Cp}
R384 N836 N853 {Rsh}
R385 N836 N814 {Rs}
I193 N811 N787 {Iph}
D385 N787 N811 diffusion
D386 N787 N811 recombination
C193 N787 N811 {Cp}
R386 N787 N811 {Rsh}
R387 N787 N763 {Rs}
I194 N764 N813 {Iph}
D387 N813 N764 diffusion
D388 N813 N764 recombination
C194 N813 N764 {Cp}
R388 N813 N764 {Rsh}
R389 N813 N812 {Rs}
I195 N767 N816 {Iph}
D389 N816 N767 diffusion
D390 N816 N767 recombination
C195 N816 N767 {Cp}
R390 N816 N767 {Rsh}
R391 N816 N815 {Rs}
I196 N814 N788 {Iph}
D391 N788 N814 diffusion
D392 N788 N814 recombination
C196 N788 N814 {Cp}
R392 N788 N814 {Rsh}
R393 N788 N766 {Rs}
I197 N763 N739 {Iph}
D393 N739 N763 diffusion
D394 N739 N763 recombination
C197 N739 N763 {Cp}
R394 N739 N763 {Rsh}
R395 N739 N715 {Rs}
I198 N716 N765 {Iph}
D395 N765 N716 diffusion
D396 N765 N716 recombination
C198 N765 N716 {Cp}
R396 N765 N716 {Rsh}
R397 N765 N764 {Rs}
I199 N719 N768 {Iph}
D397 N768 N719 diffusion
D398 N768 N719 recombination
C199 N768 N719 {Cp}
R398 N768 N719 {Rsh}
R399 N768 N767 {Rs}
I200 N766 N740 {Iph}
D399 N740 N766 diffusion
D400 N740 N766 recombination
C200 N740 N766 {Cp}
R400 N740 N766 {Rsh}
R401 N740 N718 {Rs}
I201 N715 N691 {Iph}
D401 N691 N715 diffusion
D402 N691 N715 recombination
C201 N691 N715 {Cp}
R402 N691 N715 {Rsh}
R403 N691 N667 {Rs}
I202 N668 N717 {Iph}
D403 N717 N668 diffusion
D404 N717 N668 recombination
C202 N717 N668 {Cp}
R404 N717 N668 {Rsh}
R405 N717 N716 {Rs}
I203 N671 N720 {Iph}
D405 N720 N671 diffusion
D406 N720 N671 recombination
C203 N720 N671 {Cp}
R406 N720 N671 {Rsh}
R407 N720 N719 {Rs}
I204 N718 N692 {Iph}
D407 N692 N718 diffusion
D408 N692 N718 recombination
C204 N692 N718 {Cp}
R408 N692 N718 {Rsh}
R409 N692 N670 {Rs}
I205 N667 N643 {Iph}
D409 N643 N667 diffusion
D410 N643 N667 recombination
C205 N643 N667 {Cp}
R410 N643 N667 {Rsh}
R411 N643 N619 {Rs}
I206 N620 N669 {Iph}
D411 N669 N620 diffusion
D412 N669 N620 recombination
C206 N669 N620 {Cp}
R412 N669 N620 {Rsh}
R413 N669 N668 {Rs}
I207 N623 N672 {Iph}
D413 N672 N623 diffusion
D414 N672 N623 recombination
C207 N672 N623 {Cp}
R414 N672 N623 {Rsh}
R415 N672 N671 {Rs}
I208 N670 N644 {Iph}
D415 N644 N670 diffusion
D416 N644 N670 recombination
C208 N644 N670 {Cp}
R416 N644 N670 {Rsh}
R417 N644 N622 {Rs}
I209 N619 N595 {Iph}
D417 N595 N619 diffusion
D418 N595 N619 recombination
C209 N595 N619 {Cp}
R418 N595 N619 {Rsh}
R419 N595 N571 {Rs}
I210 N572 N621 {Iph}
D419 N621 N572 diffusion
D420 N621 N572 recombination
C210 N621 N572 {Cp}
R420 N621 N572 {Rsh}
R421 N621 N620 {Rs}
I211 N575 N624 {Iph}
D421 N624 N575 diffusion
D422 N624 N575 recombination
C211 N624 N575 {Cp}
R422 N624 N575 {Rsh}
R423 N624 N623 {Rs}
I212 N622 N596 {Iph}
D423 N596 N622 diffusion
D424 N596 N622 recombination
C212 N596 N622 {Cp}
R424 N596 N622 {Rsh}
R425 N596 N574 {Rs}
I213 N571 N547 {Iph}
D425 N547 N571 diffusion
D426 N547 N571 recombination
C213 N547 N571 {Cp}
R426 N547 N571 {Rsh}
R427 N547 N523 {Rs}
I214 N524 N573 {Iph}
D427 N573 N524 diffusion
D428 N573 N524 recombination
C214 N573 N524 {Cp}
R428 N573 N524 {Rsh}
R429 N573 N572 {Rs}
I215 N527 N576 {Iph}
D429 N576 N527 diffusion
D430 N576 N527 recombination
C215 N576 N527 {Cp}
R430 N576 N527 {Rsh}
R431 N576 N575 {Rs}
I216 N574 N548 {Iph}
D431 N548 N574 diffusion
D432 N548 N574 recombination
C216 N548 N574 {Cp}
R432 N548 N574 {Rsh}
R433 N548 N526 {Rs}
I217 N517 N497 {Iph}
D433 N497 N517 diffusion
D434 N497 N517 recombination
C217 N497 N517 {Cp}
R434 N497 N517 {Rsh}
R435 N497 N469 {Rs}
I218 N470 N519 {Iph}
D435 N519 N470 diffusion
D436 N519 N470 recombination
C218 N519 N470 {Cp}
R436 N519 N470 {Rsh}
R437 N519 N518 {Rs}
I219 N473 N522 {Iph}
D437 N522 N473 diffusion
D438 N522 N473 recombination
C219 N522 N473 {Cp}
R438 N522 N473 {Rsh}
R439 N522 N521 {Rs}
I220 N520 N498 {Iph}
D439 N498 N520 diffusion
D440 N498 N520 recombination
C220 N498 N520 {Cp}
R440 N498 N520 {Rsh}
R441 N498 N472 {Rs}
I221 N469 N449 {Iph}
D441 N449 N469 diffusion
D442 N449 N469 recombination
C221 N449 N469 {Cp}
R442 N449 N469 {Rsh}
R443 N449 N421 {Rs}
I222 N422 N471 {Iph}
D443 N471 N422 diffusion
D444 N471 N422 recombination
C222 N471 N422 {Cp}
R444 N471 N422 {Rsh}
R445 N471 N470 {Rs}
I223 N425 N474 {Iph}
D445 N474 N425 diffusion
D446 N474 N425 recombination
C223 N474 N425 {Cp}
R446 N474 N425 {Rsh}
R447 N474 N473 {Rs}
I224 N472 N450 {Iph}
D447 N450 N472 diffusion
D448 N450 N472 recombination
C224 N450 N472 {Cp}
R448 N450 N472 {Rsh}
R449 N450 N424 {Rs}
I225 N421 N401 {Iph}
D449 N401 N421 diffusion
D450 N401 N421 recombination
C225 N401 N421 {Cp}
R450 N401 N421 {Rsh}
R451 N401 N373 {Rs}
I226 N374 N423 {Iph}
D451 N423 N374 diffusion
D452 N423 N374 recombination
C226 N423 N374 {Cp}
R452 N423 N374 {Rsh}
R453 N423 N422 {Rs}
I227 N377 N426 {Iph}
D453 N426 N377 diffusion
D454 N426 N377 recombination
C227 N426 N377 {Cp}
R454 N426 N377 {Rsh}
R455 N426 N425 {Rs}
I228 N424 N402 {Iph}
D455 N402 N424 diffusion
D456 N402 N424 recombination
C228 N402 N424 {Cp}
R456 N402 N424 {Rsh}
R457 N402 N376 {Rs}
I229 N373 N353 {Iph}
D457 N353 N373 diffusion
D458 N353 N373 recombination
C229 N353 N373 {Cp}
R458 N353 N373 {Rsh}
R459 N353 N325 {Rs}
I230 N326 N375 {Iph}
D459 N375 N326 diffusion
D460 N375 N326 recombination
C230 N375 N326 {Cp}
R460 N375 N326 {Rsh}
R461 N375 N374 {Rs}
I231 N329 N378 {Iph}
D461 N378 N329 diffusion
D462 N378 N329 recombination
C231 N378 N329 {Cp}
R462 N378 N329 {Rsh}
R463 N378 N377 {Rs}
I232 N376 N354 {Iph}
D463 N354 N376 diffusion
D464 N354 N376 recombination
C232 N354 N376 {Cp}
R464 N354 N376 {Rsh}
R465 N354 N328 {Rs}
I233 N325 N305 {Iph}
D465 N305 N325 diffusion
D466 N305 N325 recombination
C233 N305 N325 {Cp}
R466 N305 N325 {Rsh}
R467 N305 N277 {Rs}
I234 N278 N327 {Iph}
D467 N327 N278 diffusion
D468 N327 N278 recombination
C234 N327 N278 {Cp}
R468 N327 N278 {Rsh}
R469 N327 N326 {Rs}
I235 N281 N330 {Iph}
D469 N330 N281 diffusion
D470 N330 N281 recombination
C235 N330 N281 {Cp}
R470 N330 N281 {Rsh}
R471 N330 N329 {Rs}
I236 N328 N306 {Iph}
D471 N306 N328 diffusion
D472 N306 N328 recombination
C236 N306 N328 {Cp}
R472 N306 N328 {Rsh}
R473 N306 N280 {Rs}
I237 N277 N257 {Iph}
D473 N257 N277 diffusion
D474 N257 N277 recombination
C237 N257 N277 {Cp}
R474 N257 N277 {Rsh}
R475 N257 N229 {Rs}
I238 N230 N279 {Iph}
D475 N279 N230 diffusion
D476 N279 N230 recombination
C238 N279 N230 {Cp}
R476 N279 N230 {Rsh}
R477 N279 N278 {Rs}
I239 N233 N282 {Iph}
D477 N282 N233 diffusion
D478 N282 N233 recombination
C239 N282 N233 {Cp}
R478 N282 N233 {Rsh}
R479 N282 N281 {Rs}
I240 N280 N258 {Iph}
D479 N258 N280 diffusion
D480 N258 N280 recombination
C240 N258 N280 {Cp}
R480 N258 N280 {Rsh}
R481 N258 N232 {Rs}
I241 N229 N209 {Iph}
D481 N209 N229 diffusion
D482 N209 N229 recombination
C241 N209 N229 {Cp}
R482 N209 N229 {Rsh}
R483 N209 N181 {Rs}
I242 N182 N231 {Iph}
D483 N231 N182 diffusion
D484 N231 N182 recombination
C242 N231 N182 {Cp}
R484 N231 N182 {Rsh}
R485 N231 N230 {Rs}
I243 N185 N234 {Iph}
D485 N234 N185 diffusion
D486 N234 N185 recombination
C243 N234 N185 {Cp}
R486 N234 N185 {Rsh}
R487 N234 N233 {Rs}
I244 N232 N210 {Iph}
D487 N210 N232 diffusion
D488 N210 N232 recombination
C244 N210 N232 {Cp}
R488 N210 N232 {Rsh}
R489 N210 N184 {Rs}
I245 N181 N161 {Iph}
D489 N161 N181 diffusion
D490 N161 N181 recombination
C245 N161 N181 {Cp}
R490 N161 N181 {Rsh}
R491 N161 N133 {Rs}
I246 N134 N183 {Iph}
D491 N183 N134 diffusion
D492 N183 N134 recombination
C246 N183 N134 {Cp}
R492 N183 N134 {Rsh}
R493 N183 N182 {Rs}
I247 N137 N186 {Iph}
D493 N186 N137 diffusion
D494 N186 N137 recombination
C247 N186 N137 {Cp}
R494 N186 N137 {Rsh}
R495 N186 N185 {Rs}
I248 N184 N162 {Iph}
D495 N162 N184 diffusion
D496 N162 N184 recombination
C248 N162 N184 {Cp}
R496 N162 N184 {Rsh}
R497 N162 N136 {Rs}
I249 N133 N113 {Iph}
D497 N113 N133 diffusion
D498 N113 N133 recombination
C249 N113 N133 {Cp}
R498 N113 N133 {Rsh}
R499 N113 N085 {Rs}
I250 N086 N135 {Iph}
D499 N135 N086 diffusion
D500 N135 N086 recombination
C250 N135 N086 {Cp}
R500 N135 N086 {Rsh}
R501 N135 N134 {Rs}
I251 N089 N138 {Iph}
D501 N138 N089 diffusion
D502 N138 N089 recombination
C251 N138 N089 {Cp}
R502 N138 N089 {Rsh}
R503 N138 N137 {Rs}
I252 N136 N114 {Iph}
D503 N114 N136 diffusion
D504 N114 N136 recombination
C252 N114 N136 {Cp}
R504 N114 N136 {Rsh}
R505 N114 N088 {Rs}
I253 N085 N065 {Iph}
D505 N065 N085 diffusion
D506 N065 N085 recombination
C253 N065 N085 {Cp}
R506 N065 N085 {Rsh}
R507 N065 N037 {Rs}
I254 N038 N087 {Iph}
D507 N087 N038 diffusion
D508 N087 N038 recombination
C254 N087 N038 {Cp}
R508 N087 N038 {Rsh}
R509 N087 N086 {Rs}
I255 N041 N090 {Iph}
D509 N090 N041 diffusion
D510 N090 N041 recombination
C255 N090 N041 {Cp}
R510 N090 N041 {Rsh}
R511 N090 N089 {Rs}
I256 N088 N066 {Iph}
D511 N066 N088 diffusion
D512 N066 N088 recombination
C256 N066 N088 {Cp}
R512 N066 N088 {Rsh}
R513 N066 N040 {Rs}
I257 N037 N009 {Iph}
D513 N009 N037 diffusion
D514 N009 N037 recombination
C257 N009 N037 {Cp}
R514 N009 N037 {Rsh}
R515 N009 N010 {Rs}
I258 N010 N039 {Iph}
D515 N039 N010 diffusion
D516 N039 N010 recombination
C258 N039 N010 {Cp}
R516 N039 N010 {Rsh}
R517 N039 N038 {Rs}
I259 N012 N042 {Iph}
D517 N042 N012 diffusion
D518 N042 N012 recombination
C259 N042 N012 {Cp}
R518 N042 N012 {Rsh}
R519 N042 N041 {Rs}
I260 N040 N011 {Iph}
D519 N011 N040 diffusion
D520 N011 N040 recombination
C260 N011 N040 {Cp}
R520 N011 N040 {Rsh}
R521 N011 N012 {Rs}
I261 N847 N833 {Iph}
D521 N833 N847 diffusion
D522 N833 N847 recombination
C261 N833 N847 {Cp}
R522 N833 N847 {Rsh}
R523 N833 N805 {Rs}
I262 N806 N850 {Iph}
D523 N850 N806 diffusion
D524 N850 N806 recombination
C262 N850 N806 {Cp}
R524 N850 N806 {Rsh}
R525 N850 N849 {Rs}
I263 N809 N852 {Iph}
D525 N852 N809 diffusion
D526 N852 N809 recombination
C263 N852 N809 {Cp}
R526 N852 N809 {Rsh}
R527 N852 N851 {Rs}
I264 N849 N834 {Iph}
D527 N834 N849 diffusion
D528 N834 N849 recombination
C264 N834 N849 {Cp}
R528 N834 N849 {Rsh}
R529 N834 N808 {Rs}
I265 N805 N785 {Iph}
D529 N785 N805 diffusion
D530 N785 N805 recombination
C265 N785 N805 {Cp}
R530 N785 N805 {Rsh}
R531 N785 N757 {Rs}
I266 N758 N807 {Iph}
D531 N807 N758 diffusion
D532 N807 N758 recombination
C266 N807 N758 {Cp}
R532 N807 N758 {Rsh}
R533 N807 N806 {Rs}
I267 N761 N810 {Iph}
D533 N810 N761 diffusion
D534 N810 N761 recombination
C267 N810 N761 {Cp}
R534 N810 N761 {Rsh}
R535 N810 N809 {Rs}
I268 N808 N786 {Iph}
D535 N786 N808 diffusion
D536 N786 N808 recombination
C268 N786 N808 {Cp}
R536 N786 N808 {Rsh}
R537 N786 N760 {Rs}
I269 N757 N737 {Iph}
D537 N737 N757 diffusion
D538 N737 N757 recombination
C269 N737 N757 {Cp}
R538 N737 N757 {Rsh}
R539 N737 N709 {Rs}
I270 N710 N759 {Iph}
D539 N759 N710 diffusion
D540 N759 N710 recombination
C270 N759 N710 {Cp}
R540 N759 N710 {Rsh}
R541 N759 N758 {Rs}
I271 N713 N762 {Iph}
D541 N762 N713 diffusion
D542 N762 N713 recombination
C271 N762 N713 {Cp}
R542 N762 N713 {Rsh}
R543 N762 N761 {Rs}
I272 N760 N738 {Iph}
D543 N738 N760 diffusion
D544 N738 N760 recombination
C272 N738 N760 {Cp}
R544 N738 N760 {Rsh}
R545 N738 N712 {Rs}
I273 N709 N689 {Iph}
D545 N689 N709 diffusion
D546 N689 N709 recombination
C273 N689 N709 {Cp}
R546 N689 N709 {Rsh}
R547 N689 N661 {Rs}
I274 N662 N711 {Iph}
D547 N711 N662 diffusion
D548 N711 N662 recombination
C274 N711 N662 {Cp}
R548 N711 N662 {Rsh}
R549 N711 N710 {Rs}
I275 N665 N714 {Iph}
D549 N714 N665 diffusion
D550 N714 N665 recombination
C275 N714 N665 {Cp}
R550 N714 N665 {Rsh}
R551 N714 N713 {Rs}
I276 N712 N690 {Iph}
D551 N690 N712 diffusion
D552 N690 N712 recombination
C276 N690 N712 {Cp}
R552 N690 N712 {Rsh}
R553 N690 N664 {Rs}
I277 N661 N641 {Iph}
D553 N641 N661 diffusion
D554 N641 N661 recombination
C277 N641 N661 {Cp}
R554 N641 N661 {Rsh}
R555 N641 N613 {Rs}
I278 N614 N663 {Iph}
D555 N663 N614 diffusion
D556 N663 N614 recombination
C278 N663 N614 {Cp}
R556 N663 N614 {Rsh}
R557 N663 N662 {Rs}
I279 N617 N666 {Iph}
D557 N666 N617 diffusion
D558 N666 N617 recombination
C279 N666 N617 {Cp}
R558 N666 N617 {Rsh}
R559 N666 N665 {Rs}
I280 N664 N642 {Iph}
D559 N642 N664 diffusion
D560 N642 N664 recombination
C280 N642 N664 {Cp}
R560 N642 N664 {Rsh}
R561 N642 N616 {Rs}
I281 N613 N593 {Iph}
D561 N593 N613 diffusion
D562 N593 N613 recombination
C281 N593 N613 {Cp}
R562 N593 N613 {Rsh}
R563 N593 N565 {Rs}
I282 N566 N615 {Iph}
D563 N615 N566 diffusion
D564 N615 N566 recombination
C282 N615 N566 {Cp}
R564 N615 N566 {Rsh}
R565 N615 N614 {Rs}
I283 N569 N618 {Iph}
D565 N618 N569 diffusion
D566 N618 N569 recombination
C283 N618 N569 {Cp}
R566 N618 N569 {Rsh}
R567 N618 N617 {Rs}
I284 N616 N594 {Iph}
D567 N594 N616 diffusion
D568 N594 N616 recombination
C284 N594 N616 {Cp}
R568 N594 N616 {Rsh}
R569 N594 N568 {Rs}
I285 N565 N545 {Iph}
D569 N545 N565 diffusion
D570 N545 N565 recombination
C285 N545 N565 {Cp}
R570 N545 N565 {Rsh}
R571 N545 N517 {Rs}
I286 N518 N567 {Iph}
D571 N567 N518 diffusion
D572 N567 N518 recombination
C286 N567 N518 {Cp}
R572 N567 N518 {Rsh}
R573 N567 N566 {Rs}
I287 N521 N570 {Iph}
D573 N570 N521 diffusion
D574 N570 N521 recombination
C287 N570 N521 {Cp}
R574 N570 N521 {Rsh}
R575 N570 N569 {Rs}
I288 N568 N546 {Iph}
D575 N546 N568 diffusion
D576 N546 N568 recombination
C288 N546 N568 {Cp}
R576 N546 N568 {Rsh}
R577 N546 N520 {Rs}
I289 N511 N495 {Iph}
D577 N495 N511 diffusion
D578 N495 N511 recombination
C289 N495 N511 {Cp}
R578 N495 N511 {Rsh}
R579 N495 N463 {Rs}
I290 N464 N513 {Iph}
D579 N513 N464 diffusion
D580 N513 N464 recombination
C290 N513 N464 {Cp}
R580 N513 N464 {Rsh}
R581 N513 N512 {Rs}
I291 N467 N516 {Iph}
D581 N516 N467 diffusion
D582 N516 N467 recombination
C291 N516 N467 {Cp}
R582 N516 N467 {Rsh}
R583 N516 N515 {Rs}
I292 N514 N496 {Iph}
D583 N496 N514 diffusion
D584 N496 N514 recombination
C292 N496 N514 {Cp}
R584 N496 N514 {Rsh}
R585 N496 N466 {Rs}
I293 N463 N447 {Iph}
D585 N447 N463 diffusion
D586 N447 N463 recombination
C293 N447 N463 {Cp}
R586 N447 N463 {Rsh}
R587 N447 N415 {Rs}
I294 N416 N465 {Iph}
D587 N465 N416 diffusion
D588 N465 N416 recombination
C294 N465 N416 {Cp}
R588 N465 N416 {Rsh}
R589 N465 N464 {Rs}
I295 N419 N468 {Iph}
D589 N468 N419 diffusion
D590 N468 N419 recombination
C295 N468 N419 {Cp}
R590 N468 N419 {Rsh}
R591 N468 N467 {Rs}
I296 N466 N448 {Iph}
D591 N448 N466 diffusion
D592 N448 N466 recombination
C296 N448 N466 {Cp}
R592 N448 N466 {Rsh}
R593 N448 N418 {Rs}
I297 N415 N399 {Iph}
D593 N399 N415 diffusion
D594 N399 N415 recombination
C297 N399 N415 {Cp}
R594 N399 N415 {Rsh}
R595 N399 N367 {Rs}
I298 N368 N417 {Iph}
D595 N417 N368 diffusion
D596 N417 N368 recombination
C298 N417 N368 {Cp}
R596 N417 N368 {Rsh}
R597 N417 N416 {Rs}
I299 N371 N420 {Iph}
D597 N420 N371 diffusion
D598 N420 N371 recombination
C299 N420 N371 {Cp}
R598 N420 N371 {Rsh}
R599 N420 N419 {Rs}
I300 N418 N400 {Iph}
D599 N400 N418 diffusion
D600 N400 N418 recombination
C300 N400 N418 {Cp}
R600 N400 N418 {Rsh}
R601 N400 N370 {Rs}
I301 N367 N351 {Iph}
D601 N351 N367 diffusion
D602 N351 N367 recombination
C301 N351 N367 {Cp}
R602 N351 N367 {Rsh}
R603 N351 N319 {Rs}
I302 N320 N369 {Iph}
D603 N369 N320 diffusion
D604 N369 N320 recombination
C302 N369 N320 {Cp}
R604 N369 N320 {Rsh}
R605 N369 N368 {Rs}
I303 N323 N372 {Iph}
D605 N372 N323 diffusion
D606 N372 N323 recombination
C303 N372 N323 {Cp}
R606 N372 N323 {Rsh}
R607 N372 N371 {Rs}
I304 N370 N352 {Iph}
D607 N352 N370 diffusion
D608 N352 N370 recombination
C304 N352 N370 {Cp}
R608 N352 N370 {Rsh}
R609 N352 N322 {Rs}
I305 N319 N303 {Iph}
D609 N303 N319 diffusion
D610 N303 N319 recombination
C305 N303 N319 {Cp}
R610 N303 N319 {Rsh}
R611 N303 N271 {Rs}
I306 N272 N321 {Iph}
D611 N321 N272 diffusion
D612 N321 N272 recombination
C306 N321 N272 {Cp}
R612 N321 N272 {Rsh}
R613 N321 N320 {Rs}
I307 N275 N324 {Iph}
D613 N324 N275 diffusion
D614 N324 N275 recombination
C307 N324 N275 {Cp}
R614 N324 N275 {Rsh}
R615 N324 N323 {Rs}
I308 N322 N304 {Iph}
D615 N304 N322 diffusion
D616 N304 N322 recombination
C308 N304 N322 {Cp}
R616 N304 N322 {Rsh}
R617 N304 N274 {Rs}
I309 N271 N255 {Iph}
D617 N255 N271 diffusion
D618 N255 N271 recombination
C309 N255 N271 {Cp}
R618 N255 N271 {Rsh}
R619 N255 N223 {Rs}
I310 N224 N273 {Iph}
D619 N273 N224 diffusion
D620 N273 N224 recombination
C310 N273 N224 {Cp}
R620 N273 N224 {Rsh}
R621 N273 N272 {Rs}
I311 N227 N276 {Iph}
D621 N276 N227 diffusion
D622 N276 N227 recombination
C311 N276 N227 {Cp}
R622 N276 N227 {Rsh}
R623 N276 N275 {Rs}
I312 N274 N256 {Iph}
D623 N256 N274 diffusion
D624 N256 N274 recombination
C312 N256 N274 {Cp}
R624 N256 N274 {Rsh}
R625 N256 N226 {Rs}
I313 N223 N207 {Iph}
D625 N207 N223 diffusion
D626 N207 N223 recombination
C313 N207 N223 {Cp}
R626 N207 N223 {Rsh}
R627 N207 N175 {Rs}
I314 N176 N225 {Iph}
D627 N225 N176 diffusion
D628 N225 N176 recombination
C314 N225 N176 {Cp}
R628 N225 N176 {Rsh}
R629 N225 N224 {Rs}
I315 N179 N228 {Iph}
D629 N228 N179 diffusion
D630 N228 N179 recombination
C315 N228 N179 {Cp}
R630 N228 N179 {Rsh}
R631 N228 N227 {Rs}
I316 N226 N208 {Iph}
D631 N208 N226 diffusion
D632 N208 N226 recombination
C316 N208 N226 {Cp}
R632 N208 N226 {Rsh}
R633 N208 N178 {Rs}
I317 N175 N159 {Iph}
D633 N159 N175 diffusion
D634 N159 N175 recombination
C317 N159 N175 {Cp}
R634 N159 N175 {Rsh}
R635 N159 N127 {Rs}
I318 N128 N177 {Iph}
D635 N177 N128 diffusion
D636 N177 N128 recombination
C318 N177 N128 {Cp}
R636 N177 N128 {Rsh}
R637 N177 N176 {Rs}
I319 N131 N180 {Iph}
D637 N180 N131 diffusion
D638 N180 N131 recombination
C319 N180 N131 {Cp}
R638 N180 N131 {Rsh}
R639 N180 N179 {Rs}
I320 N178 N160 {Iph}
D639 N160 N178 diffusion
D640 N160 N178 recombination
C320 N160 N178 {Cp}
R640 N160 N178 {Rsh}
R641 N160 N130 {Rs}
I321 N127 N111 {Iph}
D641 N111 N127 diffusion
D642 N111 N127 recombination
C321 N111 N127 {Cp}
R642 N111 N127 {Rsh}
R643 N111 N079 {Rs}
I322 N080 N129 {Iph}
D643 N129 N080 diffusion
D644 N129 N080 recombination
C322 N129 N080 {Cp}
R644 N129 N080 {Rsh}
R645 N129 N128 {Rs}
I323 N083 N132 {Iph}
D645 N132 N083 diffusion
D646 N132 N083 recombination
C323 N132 N083 {Cp}
R646 N132 N083 {Rsh}
R647 N132 N131 {Rs}
I324 N130 N112 {Iph}
D647 N112 N130 diffusion
D648 N112 N130 recombination
C324 N112 N130 {Cp}
R648 N112 N130 {Rsh}
R649 N112 N082 {Rs}
I325 N079 N063 {Iph}
D649 N063 N079 diffusion
D650 N063 N079 recombination
C325 N063 N079 {Cp}
R650 N063 N079 {Rsh}
R651 N063 N031 {Rs}
I326 N032 N081 {Iph}
D651 N081 N032 diffusion
D652 N081 N032 recombination
C326 N081 N032 {Cp}
R652 N081 N032 {Rsh}
R653 N081 N080 {Rs}
I327 N035 N084 {Iph}
D653 N084 N035 diffusion
D654 N084 N035 recombination
C327 N084 N035 {Cp}
R654 N084 N035 {Rsh}
R655 N084 N083 {Rs}
I328 N082 N064 {Iph}
D655 N064 N082 diffusion
D656 N064 N082 recombination
C328 N064 N082 {Cp}
R656 N064 N082 {Rsh}
R657 N064 N034 {Rs}
I329 N031 N005 {Iph}
D657 N005 N031 diffusion
D658 N005 N031 recombination
C329 N005 N031 {Cp}
R658 N005 N031 {Rsh}
R659 N005 N006 {Rs}
I330 N006 N033 {Iph}
D659 N033 N006 diffusion
D660 N033 N006 recombination
C330 N033 N006 {Cp}
R660 N033 N006 {Rsh}
R661 N033 N032 {Rs}
I331 N008 N036 {Iph}
D661 N036 N008 diffusion
D662 N036 N008 recombination
C331 N036 N008 {Cp}
R662 N036 N008 {Rsh}
R663 N036 N035 {Rs}
I332 N034 N007 {Iph}
D663 N007 N034 diffusion
D664 N007 N034 recombination
C332 N007 N034 {Cp}
R664 N007 N034 {Rsh}
R665 N007 N008 {Rs}
I333 N843 N831 {Iph}
D665 N831 N843 diffusion
D666 N831 N843 recombination
C333 N831 N843 {Cp}
R666 N831 N843 {Rsh}
R667 N831 N799 {Rs}
I334 N800 N846 {Iph}
D667 N846 N800 diffusion
D668 N846 N800 recombination
C334 N846 N800 {Cp}
R668 N846 N800 {Rsh}
R669 N846 N845 {Rs}
I335 N803 N848 {Iph}
D669 N848 N803 diffusion
D670 N848 N803 recombination
C335 N848 N803 {Cp}
R670 N848 N803 {Rsh}
R671 N848 N847 {Rs}
I336 N845 N832 {Iph}
D671 N832 N845 diffusion
D672 N832 N845 recombination
C336 N832 N845 {Cp}
R672 N832 N845 {Rsh}
R673 N832 N802 {Rs}
I337 N799 N783 {Iph}
D673 N783 N799 diffusion
D674 N783 N799 recombination
C337 N783 N799 {Cp}
R674 N783 N799 {Rsh}
R675 N783 N751 {Rs}
I338 N752 N801 {Iph}
D675 N801 N752 diffusion
D676 N801 N752 recombination
C338 N801 N752 {Cp}
R676 N801 N752 {Rsh}
R677 N801 N800 {Rs}
I339 N755 N804 {Iph}
D677 N804 N755 diffusion
D678 N804 N755 recombination
C339 N804 N755 {Cp}
R678 N804 N755 {Rsh}
R679 N804 N803 {Rs}
I340 N802 N784 {Iph}
D679 N784 N802 diffusion
D680 N784 N802 recombination
C340 N784 N802 {Cp}
R680 N784 N802 {Rsh}
R681 N784 N754 {Rs}
I341 N751 N735 {Iph}
D681 N735 N751 diffusion
D682 N735 N751 recombination
C341 N735 N751 {Cp}
R682 N735 N751 {Rsh}
R683 N735 N703 {Rs}
I342 N704 N753 {Iph}
D683 N753 N704 diffusion
D684 N753 N704 recombination
C342 N753 N704 {Cp}
R684 N753 N704 {Rsh}
R685 N753 N752 {Rs}
I343 N707 N756 {Iph}
D685 N756 N707 diffusion
D686 N756 N707 recombination
C343 N756 N707 {Cp}
R686 N756 N707 {Rsh}
R687 N756 N755 {Rs}
I344 N754 N736 {Iph}
D687 N736 N754 diffusion
D688 N736 N754 recombination
C344 N736 N754 {Cp}
R688 N736 N754 {Rsh}
R689 N736 N706 {Rs}
I345 N703 N687 {Iph}
D689 N687 N703 diffusion
D690 N687 N703 recombination
C345 N687 N703 {Cp}
R690 N687 N703 {Rsh}
R691 N687 N655 {Rs}
I346 N656 N705 {Iph}
D691 N705 N656 diffusion
D692 N705 N656 recombination
C346 N705 N656 {Cp}
R692 N705 N656 {Rsh}
R693 N705 N704 {Rs}
I347 N659 N708 {Iph}
D693 N708 N659 diffusion
D694 N708 N659 recombination
C347 N708 N659 {Cp}
R694 N708 N659 {Rsh}
R695 N708 N707 {Rs}
I348 N706 N688 {Iph}
D695 N688 N706 diffusion
D696 N688 N706 recombination
C348 N688 N706 {Cp}
R696 N688 N706 {Rsh}
R697 N688 N658 {Rs}
I349 N655 N639 {Iph}
D697 N639 N655 diffusion
D698 N639 N655 recombination
C349 N639 N655 {Cp}
R698 N639 N655 {Rsh}
R699 N639 N607 {Rs}
I350 N608 N657 {Iph}
D699 N657 N608 diffusion
D700 N657 N608 recombination
C350 N657 N608 {Cp}
R700 N657 N608 {Rsh}
R701 N657 N656 {Rs}
I351 N611 N660 {Iph}
D701 N660 N611 diffusion
D702 N660 N611 recombination
C351 N660 N611 {Cp}
R702 N660 N611 {Rsh}
R703 N660 N659 {Rs}
I352 N658 N640 {Iph}
D703 N640 N658 diffusion
D704 N640 N658 recombination
C352 N640 N658 {Cp}
R704 N640 N658 {Rsh}
R705 N640 N610 {Rs}
I353 N607 N591 {Iph}
D705 N591 N607 diffusion
D706 N591 N607 recombination
C353 N591 N607 {Cp}
R706 N591 N607 {Rsh}
R707 N591 N559 {Rs}
I354 N560 N609 {Iph}
D707 N609 N560 diffusion
D708 N609 N560 recombination
C354 N609 N560 {Cp}
R708 N609 N560 {Rsh}
R709 N609 N608 {Rs}
I355 N563 N612 {Iph}
D709 N612 N563 diffusion
D710 N612 N563 recombination
C355 N612 N563 {Cp}
R710 N612 N563 {Rsh}
R711 N612 N611 {Rs}
I356 N610 N592 {Iph}
D711 N592 N610 diffusion
D712 N592 N610 recombination
C356 N592 N610 {Cp}
R712 N592 N610 {Rsh}
R713 N592 N562 {Rs}
I357 N559 N543 {Iph}
D713 N543 N559 diffusion
D714 N543 N559 recombination
C357 N543 N559 {Cp}
R714 N543 N559 {Rsh}
R715 N543 N511 {Rs}
I358 N512 N561 {Iph}
D715 N561 N512 diffusion
D716 N561 N512 recombination
C358 N561 N512 {Cp}
R716 N561 N512 {Rsh}
R717 N561 N560 {Rs}
I359 N515 N564 {Iph}
D717 N564 N515 diffusion
D718 N564 N515 recombination
C359 N564 N515 {Cp}
R718 N564 N515 {Rsh}
R719 N564 N563 {Rs}
I360 N562 N544 {Iph}
D719 N544 N562 diffusion
D720 N544 N562 recombination
C360 N544 N562 {Cp}
R720 N544 N562 {Rsh}
R721 N544 N514 {Rs}
I361 N505 N493 {Iph}
D721 N493 N505 diffusion